# EAGLE board SDR_at86rf215 (EAGLE 7.6.0), part 1 of 2
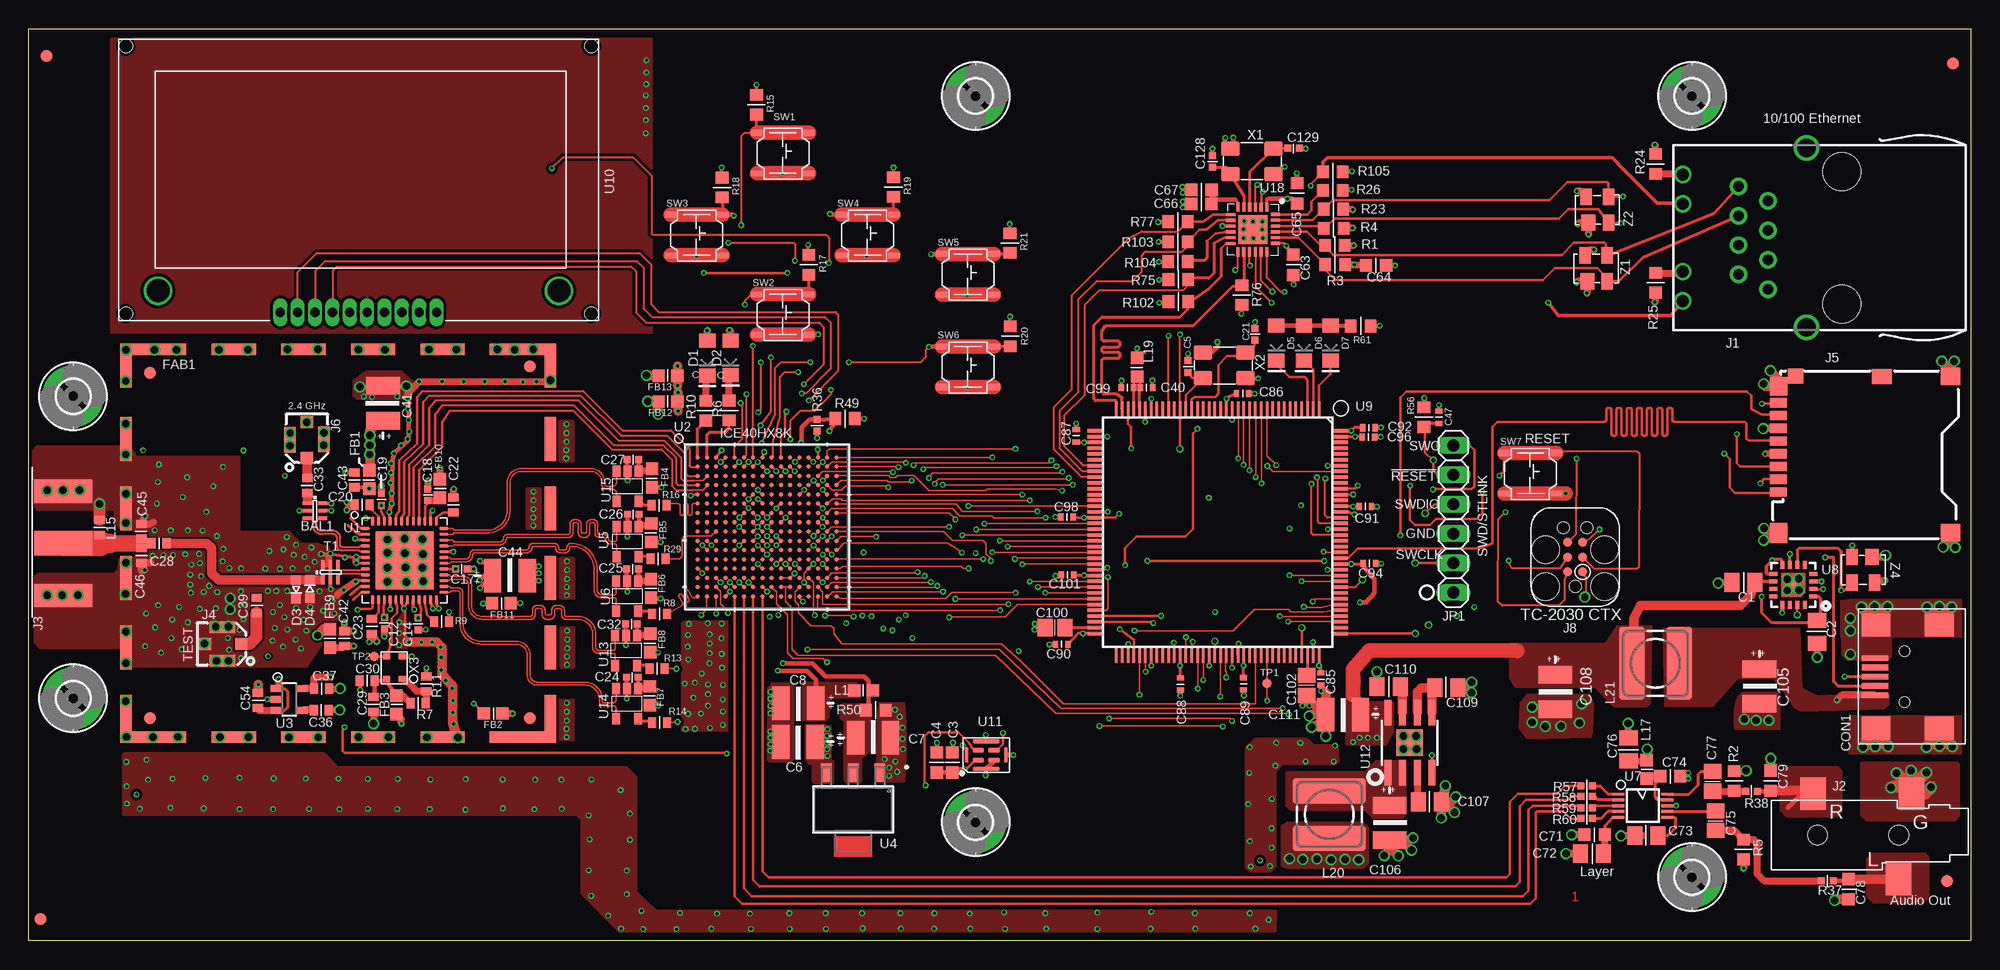
[diagram p10: board, top side]
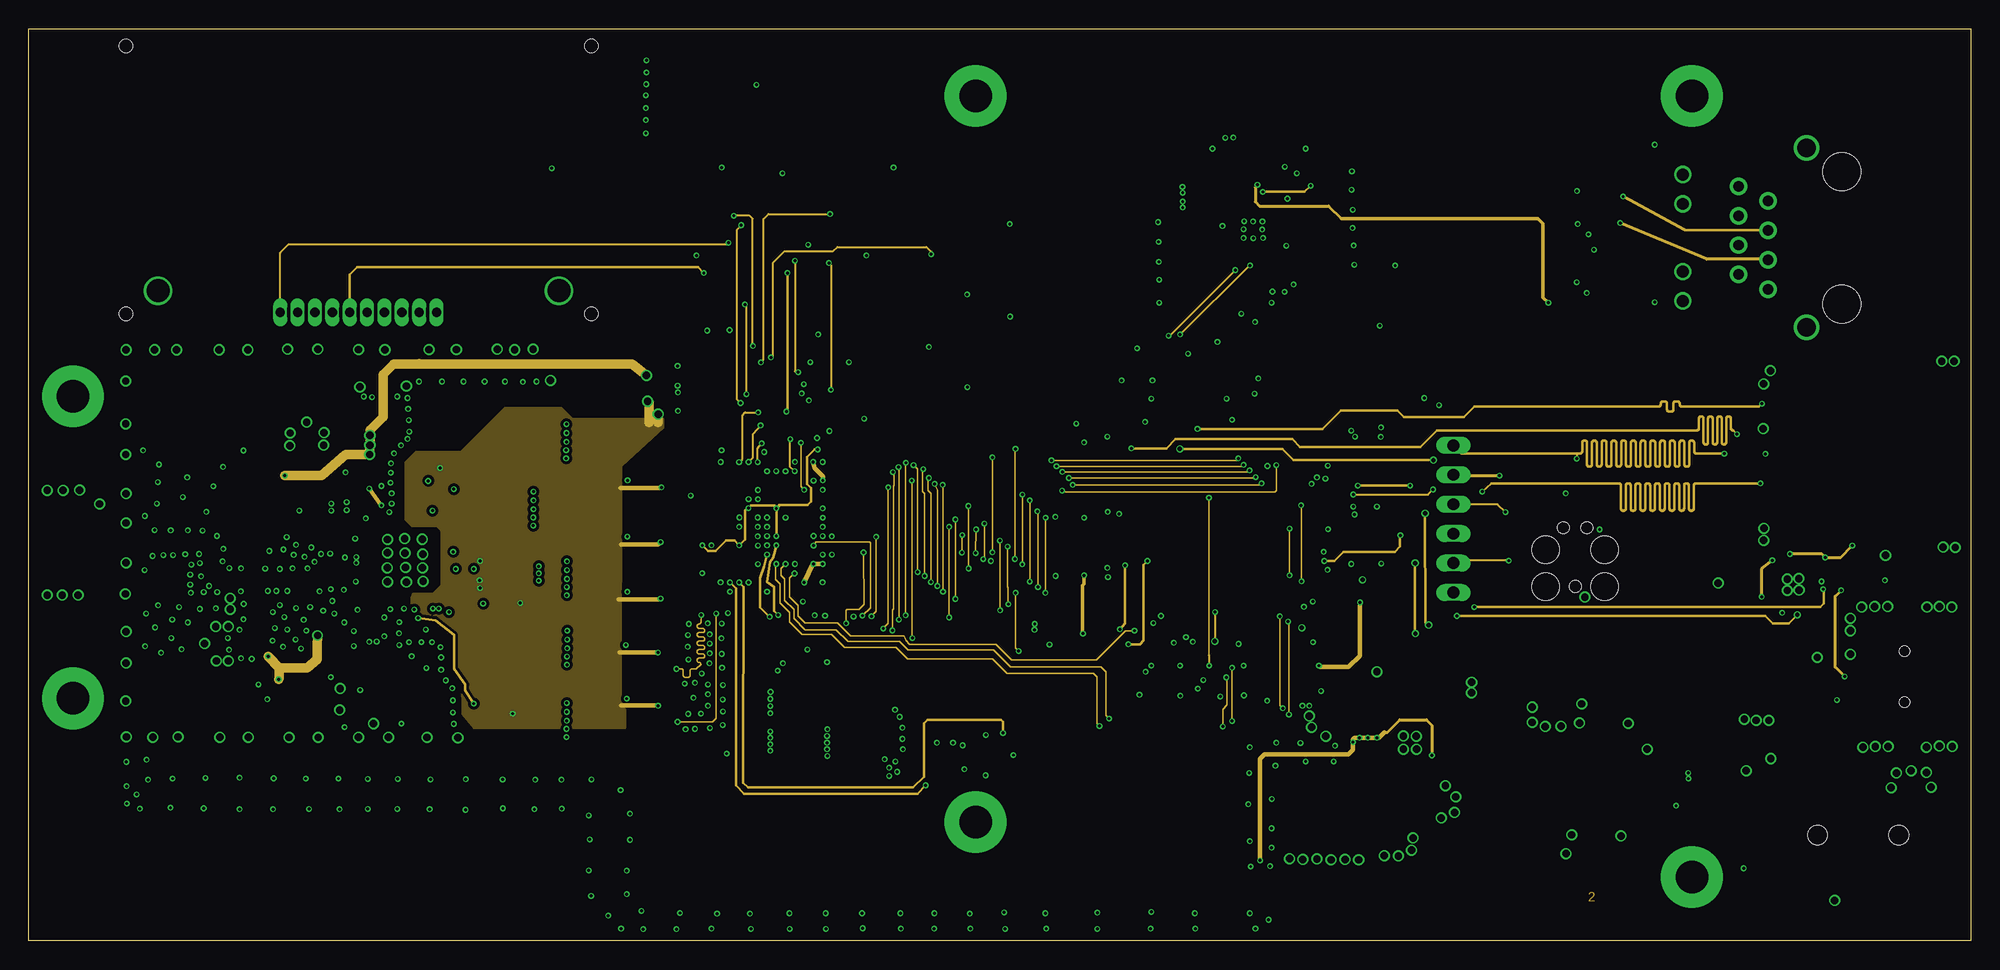
[diagram p11: board, inner layer Route2]
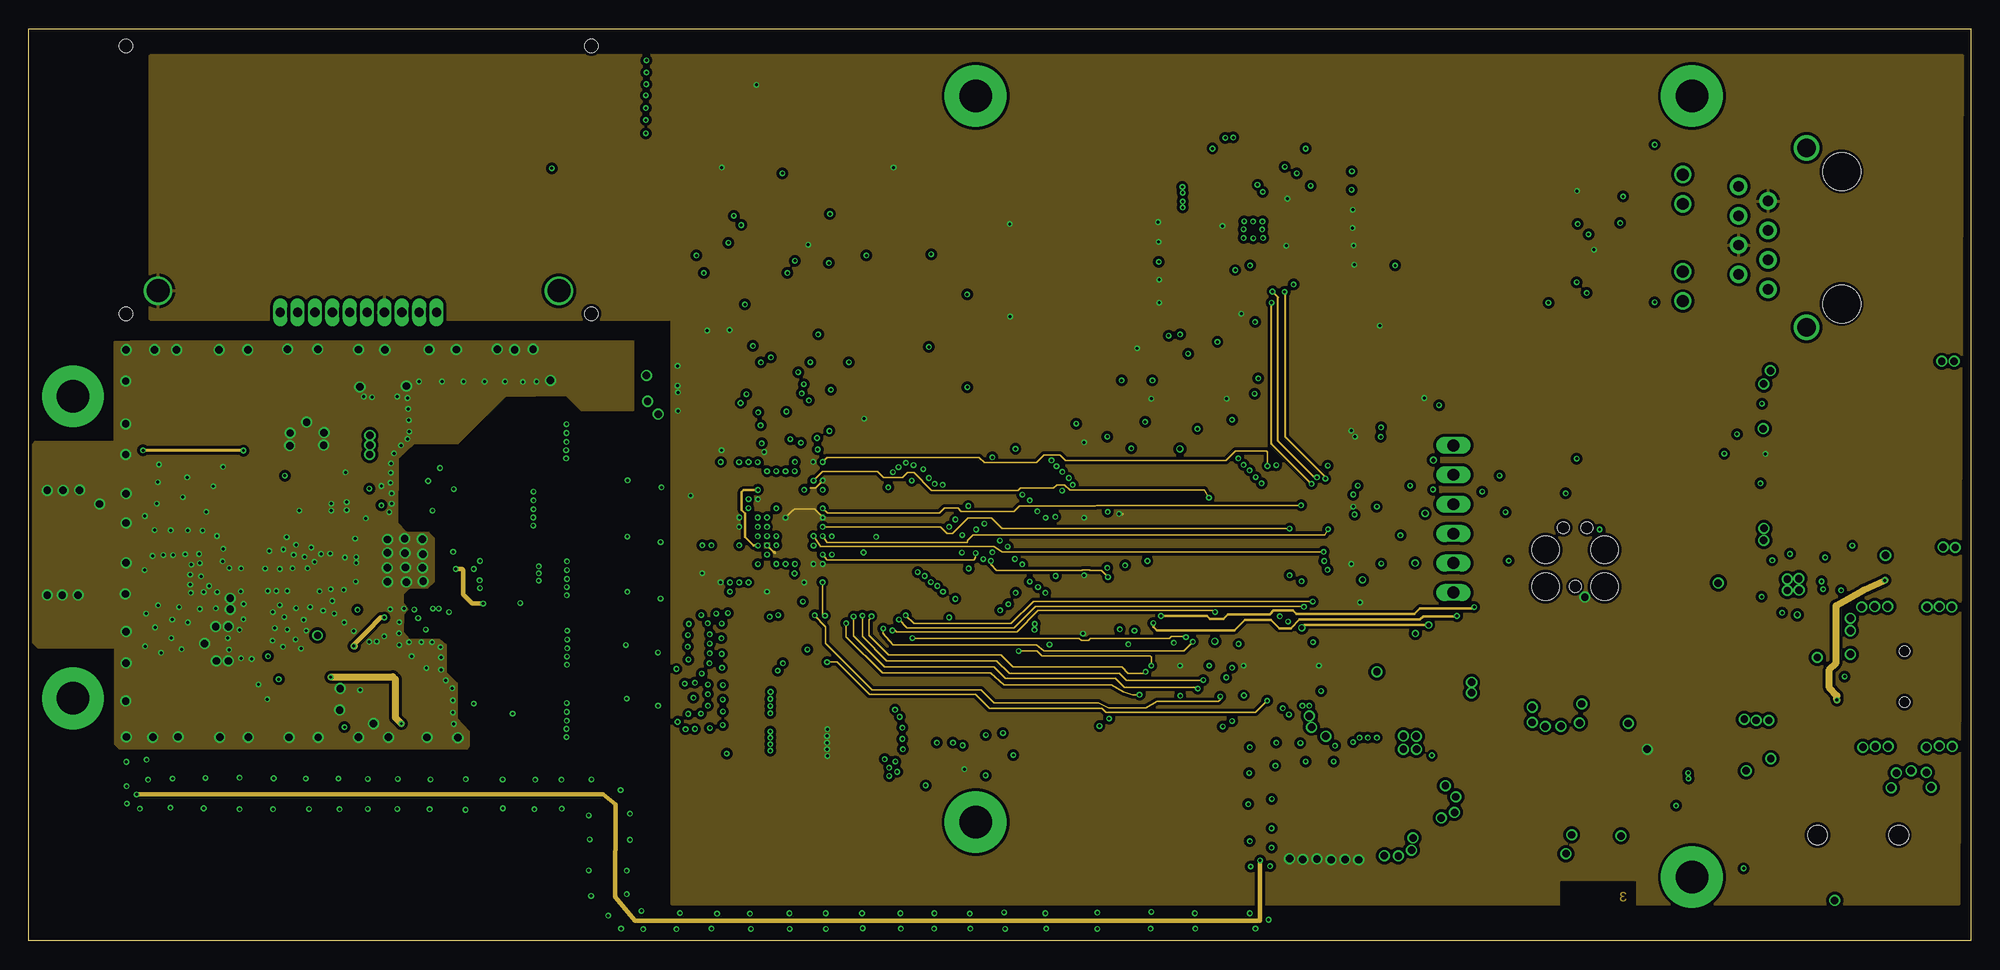
[diagram p12: board, inner layer Route3]
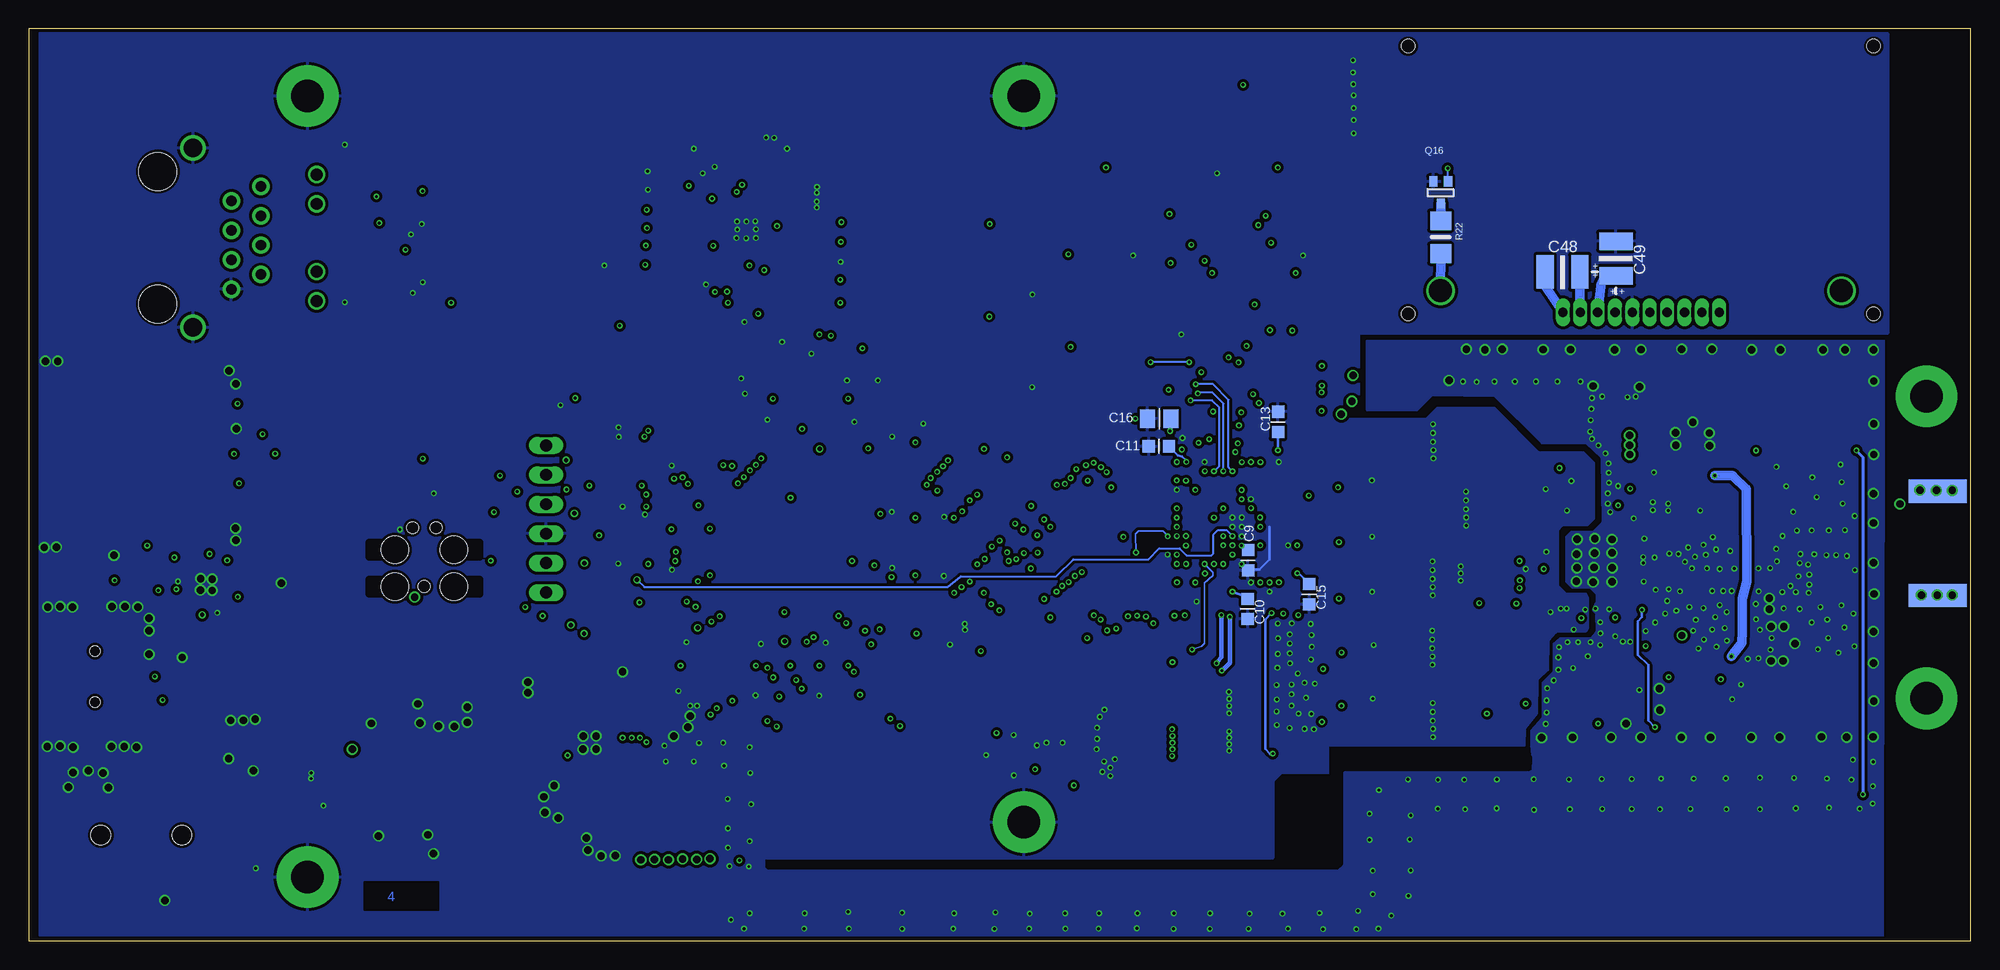
[diagram p13: board, bottom side, seen from below]

Size 167.64 x 78.74 mm. Coordinates in mm from the lower left corner, seen from the top.
Outline: 0,78.74 167.64,78.74 167.64,0 0,0 0,78.74
Copper layers (1+2+3+16): Top 0.035mm / dielectric 0.2mm / Route2 0.035mm / dielectric 0.15mm / Route3 0.035mm / dielectric 0.2mm / Bottom 0.035mm
Design rules "default *": minimum track width 5mil, minimum drill 10mil, track to track 5mil, track to pad 5mil, pad to pad 5mil, via to via 5mil, smd to smd 1mil, copper to edge 10mil, drill to drill 10mil, minimum pad ring 4.5mil, minimum via ring 4.5mil, stop-mask expansion 0mil, vias tented up to drill 25mil, thermal gap 10mil
Net classes: 1 differential: width 0.127 mm, clearance 0.127 mm
tRestrict: area 11,33.9 to 11.4,34.7

## Footprints (pad centres in the part's own frame; a part is rotated, then mirrored left to right if it is on the bottom)
BALUN = smd 0.3 x 0.8: 1 -0.635,-0.66; 2 0.015,-0.66; 3 0.665,-0.66; 4 0.665,0.64; 5 0.015,0.64; 6 -0.635,0.64
C0805 = smd 1.3 x 1.6: 1 -1,0; 2 1,0
C0603 = smd 1.05 x 1.08: 1 -0.875,0; 2 0.875,0
C0402 = smd 0.6 x 0.6: 1 -0.5,0; 2 0.501,0
1210K = smd 1.5 x 2.9: A -1.5,0; C 1.5,0
C0603' = smd 0.699 x 0.899: 1 -0.646,0; 2 0.646,0
0402 = smd 0.457 x 0.61: 1 -0.524,0; 2 0.549,0
C0805' = smd 1.3 x 1.5: 1 -0.85,0; 2 0.85,0
1734035-2 = smd 2.3 x 0.5: 1 2.9,1.45; 2 2.9,0.65; 3 2.9,-0.15; 4 2.9,-0.95; 5 2.9,-1.75 | smd 2.5 x 2: 6 -2.65,-4.6; 7 -2.65,4.3; 8 2.8,-4.6; 9 2.8,4.3 | hole 0.9: 0.35,2.05; 0.35,-2.35
LED-1206 = smd 1.2 x 1.4: A -1.5,0; C 1.5,0
SC-79_PINDIODE = smd 0.813 x 0.813: A -0.813,-0.025; C 0.787,-0.025
RF_SHIELD = smd 5.72 x 1: P$1 -15.56,-16.51; P$6 16.36,-16.51; P$7 -15.56,16.97; P$12 16.36,16.97 | smd 3.8 x 1: P$2 -8.59,-16.51; P$3 -2.59,-16.51; P$4 3.41,-16.51; P$5 9.41,-16.51; P$8 -8.59,16.97; P$9 -2.59,16.97; P$10 3.41,16.97; P$11 9.41,16.97 | smd 1 x 3.14: P$13 -17.92,-14.44; P$19 18.72,-14.44 | smd 1 x 3.8: P$14 -17.92,-8.77; P$15 -17.92,-2.77; P$16 -17.92,3.23; P$17 -17.92,9.23; P$20 18.72,-8.77; P$21 18.72,-2.77; P$22 18.72,3.23; P$23 18.72,9.23 | smd 1 x 2.8: P$18 -17.92,15.07; P$24 18.72,15.07
0603 = smd 1.067 x 1.067: 1 -0.9,0; 2 0.7,0
FIDUCIAL = smd 1.016 x 1.016: 1 0,0
2,8-PAD = drill 2.8 pad 5.334: B2,8 0,0
SI-50170 = drill 0.9 pad 1.5: 1 4.445,5.842; 2 3.175,3.302; 3 1.905,5.842; 4 0.635,3.302; 5 -0.635,5.842; 6 -1.905,3.302; 7 -3.175,5.842; 8 -4.445,3.302 | drill 1.016 pad 1.5: A1 -5.461,10.668; A2 2.921,10.668; C1 -2.921,10.668; C2 5.461,10.668 | drill 1.6 pad 2.2: S1 -7.747,0; S2 7.747,0 | hole 3.251: -5.715,-3.048; 5.715,-3.048
SJ-3523 = smd 2.2 x 2.8: G 8.1,3.6; L 7,-3.8; R -0.4,3.6 | hole 1.7: 0,0; 7,0
SMA_EDGE = smd 2 x 5: GND1 0,0; GND3 9,0 | smd 2 x 5 bottom: GND2 0,0.127; GND4 9,0.127 | smd 2.1 x 5: RF 4.5,0
UFLCONNECTOR = smd 2.2 x 1: 1 0.01,-1.46; 2 -0.01,1.46 | smd 1.05 x 1.05: 3 -1.5,0; RF 1.6,0
SD-502774-001 = smd 0.8 x 1.5: 1 3.26,-7.43; 2 2.16,-7.43; 3 1.06,-7.43; 4 -0.04,-7.43; 5 -1.14,-7.43; 6 -2.24,-7.43; 7 -3.34,-7.43; 8 -4.44,-7.43 | smd 1.29 x 1.7: DET -6.69,1.5 | smd 1.7 x 1.5: GND@1 6.8,-7.4 | smd 1.5 x 1.7: GND@2 6.78,7.44; GND@3 -6.72,7.45 | smd 1.6 x 1.5: GND@4 -5.85,-7.42 | smd 1.29 x 1.3: SW -6.76,-5.94
TC2030-IDC = smd 0.787 x 0.787: 1 -1.27,-0.635; 2 -1.27,0.635; 3 0,-0.635; 4 0,0.635; 5 1.27,-0.635; 6 1.27,0.635 | hole 2.375: -2.54,2.54; 0.635,2.54; 0.635,-2.54; -2.54,-2.54 | hole 1.016: -2.54,0; 2.54,1.016; 2.54,-1.016
1X06 = drill 1.016 long: 1 -6.35,0; 2 -3.81,0; 3 -1.27,0; 4 1.27,0; 5 3.81,0; 6 6.35,0
POWER-CHOKE_WE-TPC = smd 6.3 x 2.2: 1 0,2.05; 2 0,-2.05
SOT23_2N7002_PACKAGE = smd 0.7 x 0.9: 1 -0.642,-0.916; 2 0.641,-0.916; 3 0,0.992
R0603 = smd 1 x 1.1: 1 -0.85,0; 2 0.85,0
R0603_COMPACT = smd 0.7 x 0.9: 1 -0.65,0; 2 0.65,0
R1206 = smd 1.6 x 1.803: 1 -1.422,0; 2 1.422,0
R0402 = smd 0.6 x 0.6: 1 -0.5,0; 2 0.5,0
PBUT_SW_TACTILE_4_5MMX4_5MM = smd 1 x 0.5: 1 -2.2,1.7; 2 2.3,1.7; 3 -2.2,-1.8; 4 2.3,-1.8
TP08R = smd 0.8 x 0.8: TP 0,0
QFN48 = smd 0.8 x 0.3: 1 -3.4,2.75; 2 -3.4,2.25; 3 -3.4,1.75; 4 -3.4,1.25; 5 -3.4,0.75; 6 -3.4,0.25; 7 -3.4,-0.25; 8 -3.4,-0.75; 9 -3.4,-1.25; 10 -3.4,-1.75; 11 -3.4,-2.25; 12 -3.4,-2.75; 25 3.4,-2.75; 26 3.4,-2.25; 27 3.4,-1.75; 28 3.4,-1.25; 29 3.4,-0.75; 30 3.4,-0.25; 31 3.4,0.25; 32 3.4,0.75; 33 3.4,1.25; 34 3.4,1.75; 35 3.4,2.25; 36 3.4,2.75 | smd 0.3 x 0.8: 13 -2.75,-3.4; 14 -2.25,-3.4; 15 -1.75,-3.4; 16 -1.25,-3.4; 17 -0.75,-3.4; 18 -0.25,-3.4; 19 0.25,-3.4; 20 0.75,-3.4; 21 1.25,-3.4; 22 1.75,-3.4; 23 2.25,-3.4; 24 2.75,-3.4; 37 2.75,3.4; 38 2.25,3.4; 39 1.75,3.4; 40 1.25,3.4; 41 0.75,3.4; 42 0.25,3.4; 43 -0.25,3.4; 44 -0.75,3.4; 45 -1.25,3.4; 46 -1.75,3.4; 47 -2.25,3.4; 48 -2.75,3.4 | smd 5 x 5: GPAD 0,0
CABGA256 = smd 0.406 x 0.406: A1 -6,6; A2 -5.2,6; A3 -4.4,6; A4 -3.6,6; A5 -2.8,6; A6 -2,6; A7 -1.2,6; A8 -0.4,6; A9 0.4,6; A10 1.2,6; A11 2,6; A12 2.8,6; A13 3.6,6; A14 4.4,6; A15 5.2,6; A16 6,6; B1 -6,5.2; B2 -5.2,5.2; B3 -4.4,5.2; B4 -3.6,5.2; B5 -2.8,5.2; B6 -2,5.2; B7 -1.2,5.2; B8 -0.4,5.2; B9 0.4,5.2; B10 1.2,5.2; B11 2,5.2; B12 2.8,5.2; B13 3.6,5.2; B14 4.4,5.2; B15 5.2,5.2; B16 6,5.2; C1 -6,4.4; C2 -5.2,4.4; C3 -4.4,4.4; C4 -3.6,4.4; C5 -2.8,4.4; C6 -2,4.4; C7 -1.2,4.4; C8 -0.4,4.4; C9 0.4,4.4; C10 1.2,4.4; C11 2,4.4; C12 2.8,4.4; C13 3.6,4.4; C14 4.4,4.4; C15 5.2,4.4; C16 6,4.4; D1 -6,3.6; D2 -5.2,3.6; D3 -4.4,3.6; D4 -3.6,3.6; D5 -2.8,3.6; D6 -2,3.6; D7 -1.2,3.6; D8 -0.4,3.6; D9 0.4,3.6; D10 1.2,3.6; D11 2,3.6; D12 2.8,3.6; D13 3.6,3.6; D14 4.4,3.6; D15 5.2,3.6; D16 6,3.6; E1 -6,2.8; E2 -5.2,2.8; E3 -4.4,2.8; E4 -3.6,2.8; E5 -2.8,2.8; E6 -2,2.8; E7 -1.2,2.8; E8 -0.4,2.8; E9 0.4,2.8; E10 1.2,2.8; E11 2,2.8; E12 2.8,2.8; E13 3.6,2.8; E14 4.4,2.8; E15 5.2,2.8; E16 6,2.8; F1 -6,2; F2 -5.2,2; F3 -4.4,2; F4 -3.6,2; F5 -2.8,2; F6 -2,2; F7 -1.2,2; F8 -0.4,2; F9 0.4,2; F10 1.2,2; F11 2,2; F12 2.8,2; F13 3.6,2; F14 4.4,2; F15 5.2,2; F16 6,2; G1 -6,1.2; G2 -5.2,1.2; G3 -4.4,1.2; G4 -3.6,1.2; G5 -2.8,1.2; G6 -2,1.2; G7 -1.2,1.2; G8 -0.4,1.2; G9 0.4,1.2; G10 1.2,1.2; G11 2,1.2; G12 2.8,1.2; G13 3.6,1.2; G14 4.4,1.2; G15 5.2,1.2; G16 6,1.2; H1 -6,0.4; H2 -5.2,0.4; H3 -4.4,0.4; H4 -3.6,0.4; H5 -2.8,0.4; H6 -2,0.4; H7 -1.2,0.4; H8 -0.4,0.4; H9 0.4,0.4; H10 1.2,0.4; H11 2,0.4; H12 2.8,0.4; H13 3.6,0.4; H14 4.4,0.4; H15 5.2,0.4; H16 6,0.4; J1 -6,-0.4; J2 -5.2,-0.4; J3 -4.4,-0.4; J4 -3.6,-0.4; J5 -2.8,-0.4; J6 -2,-0.4; J7 -1.2,-0.4; J8 -0.4,-0.4; J9 0.4,-0.4; J10 1.2,-0.4; J11 2,-0.4; J12 2.8,-0.4; J13 3.6,-0.4; J14 4.4,-0.4; J15 5.2,-0.4; J16 6,-0.4; K1 -6,-1.2; K2 -5.2,-1.2; K3 -4.4,-1.2; K4 -3.6,-1.2; K5 -2.8,-1.2; K6 -2,-1.2; K7 -1.2,-1.2; K8 -0.4,-1.2; K9 0.4,-1.2; K10 1.2,-1.2; K11 2,-1.2; K12 2.8,-1.2; K13 3.6,-1.2; K14 4.4,-1.2; K15 5.2,-1.2; K16 6,-1.2; L1 -6,-2; L2 -5.2,-2; L3 -4.4,-2; L4 -3.6,-2; L5 -2.8,-2; L6 -2,-2; L7 -1.2,-2; L8 -0.4,-2; L9 0.4,-2; L10 1.2,-2; L11 2,-2; L12 2.8,-2; L13 3.6,-2; L14 4.4,-2; L15 5.2,-2; L16 6,-2; M1 -6,-2.8; M2 -5.2,-2.8; M3 -4.4,-2.8; M4 -3.6,-2.8; M5 -2.8,-2.8; M6 -2,-2.8; M7 -1.2,-2.8; M8 -0.4,-2.8; M9 0.4,-2.8; M10 1.2,-2.8; M11 2,-2.8; M12 2.8,-2.8; M13 3.6,-2.8; M14 4.4,-2.8; M15 5.2,-2.8; M16 6,-2.8; N1 -6,-3.6; N2 -5.2,-3.6; N3 -4.4,-3.6; N4 -3.6,-3.6; N5 -2.8,-3.6; N6 -2,-3.6; N7 -1.2,-3.6; N8 -0.4,-3.6; N9 0.4,-3.6; N10 1.2,-3.6; N11 2,-3.6; N12 2.8,-3.6; N13 3.6,-3.6; N14 4.4,-3.6; N15 5.2,-3.6; N16 6,-3.6; P1 -6,-4.4; P2 -5.2,-4.4; P3 -4.4,-4.4; P4 -3.6,-4.4; P5 -2.8,-4.4; P6 -2,-4.4; P7 -1.2,-4.4; P8 -0.4,-4.4; P9 0.4,-4.4; P10 1.2,-4.4; P11 2,-4.4; P12 2.8,-4.4; P13 3.6,-4.4; P14 4.4,-4.4; P15 5.2,-4.4; P16 6,-4.4; R1 -6,-5.2; R2 -5.2,-5.2; R3 -4.4,-5.2; R4 -3.6,-5.2; R5 -2.8,-5.2; R6 -2,-5.2; R7 -1.2,-5.2; R8 -0.4,-5.2; R9 0.4,-5.2; R10 1.2,-5.2; R11 2,-5.2; R12 2.8,-5.2; R13 3.6,-5.2; R14 4.4,-5.2; R15 5.2,-5.2; R16 6,-5.2; T1 -6,-6; T2 -5.2,-6; T3 -4.4,-6; T4 -3.6,-6; T5 -2.8,-6; T6 -2,-6; T7 -1.2,-6; T8 -0.4,-6; T9 0.4,-6; T10 1.2,-6; T11 2,-6; T12 2.8,-6; T13 3.6,-6; T14 4.4,-6; T15 5.2,-6; T16 6,-6
SOT23-6 = smd 0.6 x 0.9: 1 -0.72,-1.15; 2 0.23,-1.15; 3 1.18,-1.15; 4 1.18,1.15; 5 -0.71,1.15
SOT-223 = smd 0.914 x 1.6: 1 -2.3,-3.2; 2 0,-3.2; 3 2.3,-3.2
SOT23-5 = smd 0.69 x 0.99: 1 -0.95,-1.29; 2 0,-1.29; 3 0.95,-1.29; 4 0.95,1.3; 5 -0.95,1.3
MSOP10 = smd 0.25 x 1: 1 -1,-2.113; 2 -0.5,-2.113; 3 0,-2.113; 4 0.5,-2.113; 5 1,-2.113; 6 1,2.113; 7 0.5,2.113; 8 0,2.113; 9 -0.5,2.113; 10 -1,2.113
QFN16 = smd 0.7 x 0.35: 1 -1.725,0.975; 2 -1.725,0.325; 3 -1.725,-0.325; 4 -1.725,-0.975; 9 1.725,-0.975; 10 1.725,-0.325; 11 1.725,0.325; 12 1.725,0.975 | smd 0.35 x 0.7: 5 -0.975,-1.725; 6 -0.325,-1.725; 7 0.325,-1.725; 8 0.975,-1.725; 13 0.975,1.725; 14 0.325,1.725; 15 -0.325,1.725; 16 -0.975,1.725 | smd 1 x 1: TAB 0,0
STM32F407_144 = smd 1.35 x 0.32: 1 -10.625,8.75; 2 -10.625,8.25; 3 -10.625,7.75; 4 -10.625,7.25; 5 -10.625,6.75; 6 -10.625,6.25; 7 -10.625,5.75; 8 -10.625,5.25; 9 -10.625,4.75; 10 -10.625,4.25; 11 -10.625,3.75; 12 -10.625,3.25; 13 -10.625,2.75; 14 -10.625,2.25; 15 -10.625,1.75; 16 -10.625,1.25; 17 -10.625,0.75; 18 -10.625,0.25; 19 -10.625,-0.25; 20 -10.625,-0.75; 21 -10.625,-1.25; 22 -10.625,-1.75; 23 -10.625,-2.25; 24 -10.625,-2.75; 25 -10.625,-3.25; 26 -10.625,-3.75; 27 -10.625,-4.25; 28 -10.625,-4.75; 29 -10.625,-5.25; 30 -10.625,-5.75; 31 -10.625,-6.25; 32 -10.625,-6.75; 33 -10.625,-7.25; 34 -10.625,-7.75; 35 -10.625,-8.25; 36 -10.625,-8.75; 73 10.625,-8.75; 74 10.625,-8.25; 75 10.625,-7.75; 76 10.625,-7.25; 77 10.625,-6.75; 78 10.625,-6.25; 79 10.625,-5.75; 80 10.625,-5.25; 81 10.625,-4.75; 82 10.625,-4.25; 83 10.625,-3.75; 84 10.625,-3.25; 85 10.625,-2.75; 86 10.625,-2.25; 87 10.625,-1.75; 88 10.625,-1.25; 89 10.625,-0.75; 90 10.625,-0.25; 91 10.625,0.25; 92 10.625,0.75; 93 10.625,1.25; 94 10.625,1.75; 95 10.625,2.25; 96 10.625,2.75; 97 10.625,3.25; 98 10.625,3.75; 99 10.625,4.25; 100 10.625,4.75; 101 10.625,5.25; 102 10.625,5.75; 103 10.625,6.25; 104 10.625,6.75; 105 10.625,7.25; 106 10.625,7.75; 107 10.625,8.25; 108 10.625,8.75 | smd 0.32 x 1.35: 37 -8.75,-10.625; 38 -8.25,-10.625; 39 -7.75,-10.625; 40 -7.25,-10.625; 41 -6.75,-10.625; 42 -6.25,-10.625; 43 -5.75,-10.625; 44 -5.25,-10.625; 45 -4.75,-10.625; 46 -4.25,-10.625; 47 -3.75,-10.625; 48 -3.25,-10.625; 49 -2.75,-10.625; 50 -2.25,-10.625; 51 -1.75,-10.625; 52 -1.25,-10.625; 53 -0.75,-10.625; 54 -0.25,-10.625; 55 0.25,-10.625; 56 0.75,-10.625; 57 1.25,-10.625; 58 1.75,-10.625; 59 2.25,-10.625; 60 2.75,-10.625; 61 3.25,-10.625; 62 3.75,-10.625; 63 4.25,-10.625; 64 4.75,-10.625; 65 5.25,-10.625; 66 5.75,-10.625; 67 6.25,-10.625; 68 6.75,-10.625; 69 7.25,-10.625; 70 7.75,-10.625; 71 8.25,-10.625; 72 8.75,-10.625; 109 8.75,10.625; 110 8.25,10.625; 111 7.75,10.625; 112 7.25,10.625; 113 6.75,10.625; 114 6.25,10.625; 115 5.75,10.625; 116 5.25,10.625; 117 4.75,10.625; 118 4.25,10.625; 119 3.75,10.625; 120 3.25,10.625; 121 2.75,10.625; 122 2.25,10.625; 123 1.75,10.625; 124 1.25,10.625; 125 0.75,10.625; 126 0.25,10.625; 127 -0.25,10.625; 128 -0.75,10.625; 129 -1.25,10.625; 130 -1.75,10.625; 131 -2.25,10.625; 132 -2.75,10.625; 133 -3.25,10.625; 134 -3.75,10.625; 135 -4.25,10.625; 136 -4.75,10.625; 137 -5.25,10.625; 138 -5.75,10.625; 139 -6.25,10.625; 140 -6.75,10.625; 141 -7.25,10.625; 142 -7.75,10.625; 143 -8.25,10.625; 144 -8.75,10.625
NHD-C0216CZ-NSW-BBW-3V3 = drill 0.8 long: 1 -6.7,-12; 2 -5.2,-12; 3 -3.7,-12; 4 -2.2,-12; 5 -0.7,-12; 6 0.8,-12; 7 2.3,-12; 8 3.8,-12; 9 5.3,-12; 10 6.8,-12 | drill 2: A -17.25,-10.14; K 17.37,-10.14 | hole 1.15: -20.03,10.98; 20.17,10.98; -20.03,-12.12; 20.17,-12.12
HCLGA5P-3X4X1MM = smd 0.95 x 0.4: 1 -0.675,-0.425; 2 0.675,-0.425; 3 0.675,0.425; 4 -0.675,0.425 | smd 2.3 x 0.35: 5 0,-1.2; 7 0,1.2 | smd 0.35 x 1.3: 6 1.7,0; 8 -1.7,0
SO8 = smd 0.6 x 2.2: 1 -1.905,-2.62; 2 -0.635,-2.62; 3 0.635,-2.62; 4 1.905,-2.62; 5 1.905,2.58; 6 0.635,2.58; 7 -0.635,2.58; 8 -1.905,2.58 | smd 2.29 x 2.29: GPAD 0,0
QFN-24 = smd 0.28 x 0.8: 1 -1.205,-1.836; 2 -0.705,-1.836; 3 -0.205,-1.836; 4 0.295,-1.836; 5 0.795,-1.836; 6 1.295,-1.836; 13 1.3,2.03; 14 0.8,2.03; 15 0.3,2.03; 16 -0.2,2.03; 17 -0.7,2.03; 18 -1.2,2.03 | smd 0.8 x 0.28: 7 1.94,-1.191; 8 1.94,-0.691; 9 1.94,-0.191; 10 1.94,0.309; 11 1.94,0.809; 12 1.94,1.309; 19 -1.929,1.3; 20 -1.929,0.8; 21 -1.929,0.3; 22 -1.929,-0.2; 23 -1.929,-0.7; 24 -1.929,-1.2 | smd 2.5 x 2.5: GP 0,0.1
ECS-250-20-30B-DU_CRYSTAL = smd 1.6 x 1.25: 1 -1.9,-1.1; 3 1.8,1.1; GND@1 -1.9,1.1; GND@2 1.8,-1.1
CRYSTAL_2.5_2MM = smd 0.5 x 0.6: GND 1,-0.6; OUTPUT 1,0.75; VCC -0.95,-0.6; VDD -0.95,0.75
SR2.8.TCT_1PRIMARY = smd 1.397 x 1.194: 1 -1.168,0.813 | smd 1.397 x 0.991: 2 -1.168,-0.914; 3 1.067,-0.914; 4 1.067,1.016

## Placement (x,y rotation side)
BAL1  2450FB15A0100  [BALUN]  24.71,37.13 270 top
C1  10uF  [C0805]  148.03,30.94 180 top
C2  10uF  [C0805]  154.38,26.67 270 top
C3  0.1uF  [C0603]  79.73,15.39 90 top
C4  1uF  [C0603]  78.38,15.39 90 top
C5  10pF  [C0402]  100.08,49.58 270 top
C6  22uF  [1210K]  66.41,17.17 180 top
C7  22uF  [1210K]  72.89,17.53 0 top
C8  22uF  [1210K]  66.42,20.5 180 top
C9  0.1uF  [C0603]  62.38,32.85 270 bottom
C10  1uF  [C0603]  62.41,28.65 270 bottom
C11  1uF  [C0603]  70.08,42.7 180 bottom
C12  .1uF  [C0402]  30.71,27.43 90 top
C13  1uF  [C0603]  59.79,44.81 90 bottom
C14  .1uF  [C0402]  33.6,27.36 90 top
C15  1uF  [C0603]  57.1,29.92 270 bottom
C16  2.2uF  [C0805]  70.05,45.08 180 bottom
C17  .1uF  [C0402]  37.34,32.11 180 top
C18  .1uF  [C0402]  34.44,38.51 270 top
C19  .1uF  [C0402]  30.43,38.1 270 top
C20  0.47uF  [C0603']  28.78,37.64 180 top
C21  10pF  [C0402]  105.87,52.37 270 top
C22  0.47uF  [C0603']  36.65,37.62 90 top
C23  0.47uF  [C0603']  29.62,27.15 270 top
C24  .1uF  [C0402]  52.1,22.76 180 top
C25  .1uF  [C0402]  52.12,32.11 180 top
C26  .1uF  [C0402]  52.17,36.83 180 top
C27  .1uF  [C0402]  52.15,41.55 180 top
C28  100pF  [C0603']  11.23,34.32 0 top
C29  2.2uF  [C0603']  29.74,20.4 270 top
C30  100pF  [C0603']  29.21,22.45 0 top
C32  .1uF  [C0402]  52.02,27.36 180 top
C33  100pF  [C0603']  24.03,39.32 270 top
C36  .01uF  [C0603']  25.25,19.91 0 top
C37  2.2uF  [C0603']  25.27,21.77 0 top
C39  100pF  [C0603']  19.66,28.96 90 top
C40  0.1uF  [0402]  96.47,47.78 0 top
C41  470uF_tant  [1210K]  30.58,46.41 90 top
C42  2.2uF  [C0603']  27.23,26.09 90 top
C43  2.2uF  [C0603']  28.09,39.8 90 top
C44  470uF_tant  [1210K]  41.53,31.52 0 top
C45  DNP  [C0603']  9.7,35.36 270 top
C46  DNP  [C0603']  9.7,33.27 90 top
C47  0.1uF  [0402]  121.74,45.19 90 top
C48  22uF  [1210K]  35.23,57.76 180 bottom
C49  22uF  [1210K]  30.61,58.9 90 bottom
C54  2.2uF  [C0603']  19.79,20.75 90 top
C63  0.1uF  [C0603]  109.17,58.37 270 top
C64  0.1uF  [C0603]  116.31,58.32 0 top
C65  0.1uF  [C0603]  109.5,64.54 90 top
C66  1uF  [C0603]  101.22,63.63 180 top
C67  0.1uF  [C0603]  101.24,64.82 180 top
C71  0.1uF  [C0603]  135.18,9.14 180 top
C72  10uF  [C0805]  134.95,7.52 180 top
C73  10uF  [C0805]  139.65,9.09 0 top
C74  0.1uF  [C0603]  141.71,14.2 0 top
C75  2.2uF  [C0805']  145.62,10.36 90 top
C76  2.2uF  [C0805]  138.1,16.51 90 top
C77  2.2uF  [C0805']  145.36,13.77 90 top
C78  8200pF  [C0603]  157.12,4.45 270 top
C79  8200pF  [C0603]  150.39,13.82 90 top
C85  0.1uF  [0402]  111.56,22.61 270 top
C86  0.1uF  [0402]  104.77,47.24 0 top
C87  0.1uF  [0402]  90.42,43.59 90 top
C88  0.1uF  [0402]  99.42,22.17 270 top
C89  0.1uF  [0402]  104.88,22.2 270 top
C90  0.1uF  [0402]  89.18,25.6 180 top
C91  0.1uF  [0402]  115.37,37.49 0 top
C92  0.1uF  [0402]  115.67,44.3 0 top
C94  0.1uF  [0402]  115.72,32.56 0 top
C96  0.1uF  [0402]  115.65,43.48 0 top
C98  0.1uF  [0402]  89.64,36.6 180 top
C99  0.1uF  [0402]  94.87,47.78 180 top
C100  2.2uF  [C0805']  88.6,27.03 180 top
C101  0.1uF  [0402]  89.69,31.6 180 top
C102  2.2uF  [C0805']  110.31,22.05 270 top
C105  470uF_tant  [1210K]  149.4,21.97 270 top
C106  470uF_tant  [1210K]  117.47,10.19 270 top
C107  2.2uF  [C0805]  120.95,11.99 0 top
C108  470uF_tant  [1210K]  131.78,21.49 270 top
C109  2.2uF  [C0805]  122.38,21.87 0 top
C110  2.2uF  [C0805]  117.4,21.95 180 top
C111  22uF  [1210K]  113.46,19.53 180 top
C128  10pF  [C0402]  102.18,67.28 270 top
C129  10pF  [C0402]  109.19,68.43 180 top
CON1  1734035-2  [1734035-2]  162.28,22.66 180 top
D1  [LED-1206]  58.57,50.32 270 top
D2  [LED-1206]  60.58,50.34 270 top
D3  SMP1321-079LFSMD  [SC-79_PINDIODE]  23.09,30.33 270 top
D4  SMP1321-079LFSMD  [SC-79_PINDIODE]  24.23,30.38 90 top
D5  [LED-1206]  107.7,51.61 270 top
D6  [LED-1206]  110.08,51.61 270 top
D7  [LED-1206]  112.39,51.61 270 top
FAB1  2118724  [RF_SHIELD]  26.29,34.09 0 top
FB1  [0603]  29.39,39.73 270 top
FB2  [0603]  40.18,19.63 0 top
FB3  [0603]  31.72,20.47 90 top
FB4  [0603]  53.8,39.85 270 top
FB5  [0603]  53.75,35.13 270 top
FB6  [0603]  53.72,30.33 270 top
FB7  [0603]  53.59,21.06 270 top
FB8  [0603]  53.64,25.6 270 top
FB9  [0603]  26.01,26.01 270 top
FB10  [0603]  35.48,39.14 90 top
FB11  [0603]  40.89,29.16 0 top
FB12  [0603]  55.07,46.56 180 top
FB13  [0603]  55.07,48.79 180 top
FID1  FIDUCIALSMD  [FIDUCIAL]  165.61,5.16 0 top
FID2  FIDUCIALSMD  [FIDUCIAL]  1.5,76.4 0 top
FID3  FIDUCIALSMD  [FIDUCIAL]  166.14,75.77 0 top
FID4  FIDUCIALSMD  [FIDUCIAL]  1.02,1.85 0 top
FID5  FIDUCIALSMD  [FIDUCIAL]  10.46,19.2 0 top
FID6  FIDUCIALSMD  [FIDUCIAL]  10.46,49.02 0 top
FID7  FIDUCIALSMD  [FIDUCIAL]  43.26,19.2 0 top
FID8  FIDUCIALSMD  [FIDUCIAL]  43.26,49.61 0 top
H1  MOUNT-PAD-ROUND2.8  [2,8-PAD]  81.74,72.95 0 top
H2  MOUNT-PAD-ROUND2.8  [2,8-PAD]  81.74,10.24 0 top
H3  MOUNT-PAD-ROUND2.8  [2,8-PAD]  143.59,72.95 0 top
H4  MOUNT-PAD-ROUND2.8  [2,8-PAD]  143.59,5.49 0 top
H5  2.8mm  [2,8-PAD]  3.81,20.93 0 top
H6  2.8mm  [2,8-PAD]  3.81,47.02 0 top
J1  SI-50170  [SI-50170]  153.47,60.71 90 top
J2  SJ-3523  [SJ-3523]  154.43,9.12 0 top
J3  SMA0.062  [SMA_EDGE]  2.97,29.82 90 top
J4  AMPHENOL_A-1JB  [UFLCONNECTOR]  16.71,25.63 0 top
J5  5027740891  [SD-502774-001]  158.47,42.01 270 top
J6  AMPHENOL_A-1JB  [UFLCONNECTOR]  24,43.28 270 top
J8  TC2030-CTX  [TC2030-IDC]  133.5,33.12 90 top
JP1  [1X06]  122.99,36.42 90 top
L1  [0603]  71.96,21.62 180 top
L15  12nH  [C0603']  6.1,35.69 90 top
L17  [0603]  139.67,14.88 90 top
L19  [0603]  95.69,49.42 270 top
L20  22uH_744053220  [POWER-CHOKE_WE-TPC]  112.27,10.9 0 top
L21  22uH_744053220  [POWER-CHOKE_WE-TPC]  140.44,23.95 90 top
Q16  2N7002  [SOT23_2N7002_PACKAGE]  45.75,64.64 180 bottom
R1  49.9  [R0603]  112.75,60.05 180 top
R2  12.1k  [R0603]  147.22,13.79 90 top
R3  49.9  [R0603]  112.78,58.39 180 top
R4  49.9  [R0603]  112.65,61.52 180 top
R5  12.1k  [R0603]  148.03,7.87 270 top
R6  270  [R0603]  60.45,45.8 270 top
R7  470  [R0603_COMPACT]  33.6,20.5 0 top
R8  22  [R0603_COMPACT]  54.46,28.22 180 top
R9  DNP  [R0603_COMPACT]  35.64,27.56 0 top
R10  270  [R0603]  58.45,45.77 270 top
R11  470  [R0603_COMPACT]  34.32,22.17 90 top
R13  22  [R0603_COMPACT]  54.23,23.5 180 top
R14  22  [R0603_COMPACT]  54.46,18.85 180 top
R15  12.1k  [R0603]  62.81,72.19 270 top
R16  22  [R0603_COMPACT]  54.41,37.59 0 top
R17  12.1k  [R0603]  67.34,58.37 270 top
R18  12.1k  [R0603]  59.84,65.05 270 top
R19  12.1k  [R0603]  74.65,65.07 270 top
R20  12.1k  [R0603]  84.73,52.2 270 top
R21  12.1k  [R0603]  84.71,60.25 270 top
R22  82  [R1206]  45.75,60.76 270 bottom
R23  49.9  [R0603]  112.62,63.17 180 top
R24  270  [R0603]  140.44,67.08 90 top
R25  270  [R0603]  140.44,56.82 270 top
R26  12.1k  [R0603]  112.57,64.8 0 top
R29  22  [R0603_COMPACT]  54.33,32.97 0 top
R36  470  [R0402]  68.05,44.5 270 top
R37  470  [R0402]  155.27,5.16 180 top
R38  470  [R0402]  148.72,12.9 180 top
R49  49.9  [R0603]  70.46,45.08 0 top
R50  120  [R0603]  73.11,19.91 180 top
R56  12.1k  [R0603]  120.45,45.21 270 top
R57  470  [R0402]  134.49,13.36 180 top
R58  470  [R0402]  134.49,12.45 180 top
R59  470  [R0402]  134.49,11.48 180 top
R60  470  [R0402]  134.49,10.57 180 top
R61  270  [R0603]  114.99,53.09 180 top
R75  12.1k  [R0603]  99.24,57.1 0 top
R76  12.1k  [R0603]  104.72,55.75 90 top
R77  12.1k  [R0603]  99.21,62.1 0 top
R102  12.1k  [R0603]  99.24,55.19 0 top
R103  12.1k  [R0603]  99.21,60.35 0 top
R104  12.1k  [R0603]  99.21,58.65 180 top
R105  12.1k  [R0603]  112.57,66.4 0 top
SW1  45X45MM_TL3315  [PBUT_SW_TACTILE_4_5MMX4_5MM]  65.05,68.07 0 top
SW2  45X45MM_TL3315  [PBUT_SW_TACTILE_4_5MMX4_5MM]  65.05,54.13 0 top
SW3  45X45MM_TL3315  [PBUT_SW_TACTILE_4_5MMX4_5MM]  57.61,60.99 0 top
SW4  45X45MM_TL3315  [PBUT_SW_TACTILE_4_5MMX4_5MM]  72.36,60.99 0 top
SW5  45X45MM_TL3315  [PBUT_SW_TACTILE_4_5MMX4_5MM]  81.03,57.61 0 top
SW6  45X45MM_TL3315  [PBUT_SW_TACTILE_4_5MMX4_5MM]  81.03,49.61 0 top
SW7  45X45MM_TL3315  [PBUT_SW_TACTILE_4_5MMX4_5MM]  129.59,40.41 0 top
T1  0896FB15A0100  [BALUN]  26.01,31.83 0 top
TP1  PTR1TP08R  [TP08R]  106.91,22.23 0 top
TP2  PTR1TP08R  [TP08R]  29.82,24.56 0 top
U1  AT86RF215  [QFN48]  32.44,32.84 0 top
U2  ICE40HX8K-CT256  [CABGA256]  63.73,35.74 0 top
U3  TPS799X  [SOT23-6]  22.48,21.06 270 top
U4  LD1117S12TR  [SOT-223]  71.16,11.33 180 top
U5  SN65LVDT2  [SOT23-5]  51.69,34.47 180 top
U6  SN65LVDT2  [SOT23-5]  51.66,29.74 180 top
U7  CS4344  [MSOP10]  139.34,11.66 270 top
U8  FT230XQ  [QFN16]  152.35,30.71 180 top
U9  STM32H743ZIT6  [STM32F407_144]  102.64,35.28 270 top
U10  NHD-C0216CZ-NSW-BBW-3V3  [NHD-C0216CZ-NSW-BBW-3V3]  28.4,66.27 0 top
U11  MP34DT05TR-A  [HCLGA5P-3X4X1MM]  82.65,16.03 0 top
U12  ADP7156ARDZ-3.3-R7  [SO8]  119.23,17.12 0 top
U13  SN65LVDS1  [SOT23-5]  51.56,25.07 180 top
U14  SN65LVDS1  [SOT23-5]  51.64,20.47 180 top
U15  SN65LVDT2  [SOT23-5]  51.69,39.24 180 top
U18  LAN8742  [QFN-24]  105.69,61.52 180 top
X1  25MHz  [ECS-250-20-30B-DU_CRYSTAL]  105.64,67.31 0 top
X2  8MHZ  [ECS-250-20-30B-DU_CRYSTAL]  103.15,49.68 180 top
X3  ASVTX-12-A-40.000MHZ-H10-T  [CRYSTAL_2.5_2MM]  31.62,23.55 90 top
Z1  CD143A-SR05  [SR2.8.TCT_1PRIMARY]  135.36,58.12 90 top
Z2  CD143A-SR05  [SR2.8.TCT_1PRIMARY]  135.46,63.17 90 top
Z4  CD143A-SR05  [SR2.8.TCT_1PRIMARY]  158.32,31.98 270 top

## Tracks (layer width: path | path; a pad name or v marks a point on that pad's centre or on a via)
3V
  Top 0.254: 30.79,22.52 X3.VDD
  Top 0.406: 30.79,22.52 30.82,22.49 | 30.82,22.49 C30.2 29.84,21.51 C29.1 | 30.82,22.49 FB3.2
  Top 0.61: FB3.2 32.28,21.17 R7.1
3V3  (via drill 0.25, 0.25 pad 0.25, 0.25 pad 0.41, 0.64)
  Top 0.127: U2.N13 66.93,31.72 v66.93,30.94
  Top 0.152: J8.1 134.21,31.7 134.42,31.37 134.42,29.87 v134.34,29.67
  Top 0.203: v61.34,36.55 U2.G6 | v62.94,38.13 U2.F8 | U2.H10 | U2.H10 v65.33,36.54 | U2.J6 | U2.J6 v61.33,35.74 | v57.14,38.44 57.49,38.55 U2.E1 | U2.A3 v59.8,42.35 | U2.A8 v63.47,42.2 | U2.A13 v67.72,41.35 | U2.C15 | U2.C15 v68.54,39.75 | v68.54,36.53 68.53,36.54 U2.H15 | U2.N15 68.57,32.55 v68.53,32.54 68.49,32.5 | v67.73,32.54 | v67.73,32.54 U2.N13 | v66.93,30.94 U2.R13 | U2.R8 | U2.R8 v63.73,30.14 | U2.P3 v59.72,30.95 | U2.N1 v58.13,31.74 | 91.87,36.53 93.81,36.53 v94.13,36.86 | v91.11,43.03 90.95,43.03 90.8,43 90.4,43.03 C87.1 | U2.K8 | U2.K8 v63.73,34.14 | U18.19 108.36,60.22 v108.56,60.02 109.17,59.41 | U18.9 103.11,61.71 v103.05,61.72
  Top 0.254: U9.143 114.17,43.53 v114.5,43.54 115.02,43.59 C96.1 | U9.144 114.17,44.03 v114.17,44.04 114.43,44.3 C92.1 | U9.121 v114.17,32.53 v114.17,32.54 115.17,32.54 C94.1 | U9.131 114.17,37.53 v114.35,37.49 | U9.108 v111.38,23.75 111.53,23.6 C85.1 | U9.95 104.88,24.66 v104.88,23.75 C89.1 | U9.84 v99.39,23.75 99.42,23.72 C88.1 | U9.72 v91.01,26.53 | v91.01,26.53 91.01,26.52 | U9.62 91.11,31.53 | 91.11,31.53 v91.11,31.55 | U9.52 91.87,36.53 91.24,36.53 91.24,36.47 91.11,36.47 v91.11,36.53 91.11,36.5 C98.1 | U9.39 v91.11,43.03 | U9.30 96.9,45.91 v96.9,46.81 | U9.17 103.4,45.91 v103.4,46.81 103.45,46.86 C86.1 | 91.11,31.53 90.59,31.53 C101.1 | v91.01,26.53 90.57,26.53 C90.1 | C91.1 v114.35,37.49 | 114.2,37.49 v114.35,37.49 | L19.1 95.69,50.68 v95.68,51.16 | R76.1 104.67,54.85 | R77.1 98.31,62.05 | R75.1 98.36,57.07 | R102.1 98.29,55.09 | U18.1 106.88,63.5 106.88,64.06 107.01,64.08 | 109.46,63.67 C65.1 | U18.19 | 109.17,59.41 C63.1 | R3.1 113.61,58.41 | 113.61,60.17 113.6,60.16 R1.1 113.5,60.15 | 113.84,61.6 R4.1 | R23.1 113.5,63.14 | U11.1 81.72,15.6 80.95,14.83 80.05,14.83 79.88,14.66 C3.1 | R15.1 v62.81,73.91 | R18.1 59.82,65.92 v59.82,66.78 | R19.1 v74.65,66.78 | R17.1 67.28,59.27 v67.28,60.1 | R21.1 84.68,61.12 v84.68,61.9 | R20.1 84.71,53.07 v84.71,53.9
  Top 0.406: R56.1 v120.47,46.86 | R61.1 v116.64,53.11 | v114.93,29.21 115.42,29.21 116.18,30.02 116.18,31.24 115.24,32.33 115.21,32.54 C94.1 | 104.67,54.85 v104.67,54.15 | 98.31,62.05 v97.49,62.05 | R103.1 v97.54,60.35 | 98.36,57.07 v97.59,57.07 | 98.29,55.09 v97.59,55.09 | 107.01,64.08 v108.66,64.08 109.09,64.08 109.46,63.67 | C64.1 115.48,58.32 | R49.2 v72.11,45.09 | 78.18,14.38 C4.1 C3.1 | v80.77,14.81 80.02,14.81 79.88,14.66
  Top 0.61: C76.1 138.15,15.46 L17.2 139.73,15.51 v139.73,16.54 | D2.A 60.58,52.64 v60.49,52.73 | D1.A 58.57,52.68 v58.56,52.69 | v114.43,58.37 R3.1 C64.1 | 113.61,60.17 v114.38,60.05 | v114.27,61.54 R4.1 | v114.3,63.12 R23.1 | Z2.4 133.93,64.74 v133.65,64.74 | Z1.4 134.82,59.66 v135.13,59.66 | J5.4 v149.94,42.04
  Top 0.813: v56.03,47.35 56.03,46.62 FB12.1 | v56.03,45.75 56.03,46.53 | v56.01,47.93 56.01,48.75 FB13.1 | v56.01,49.63 56.01,48.82 55.98,48.79
  Route2 0.152: 67.69,41.35 v67.72,41.35
  Route2 0.305: v91.11,31.55 91.11,30.81 90.98,30.68 90.98,26.56 v91.01,26.53
  Route2 0.406: v68.54,39.75 68.54,40.09 67.82,40.82 67.69,41.35 | v66.93,30.94 67.72,32.59 | v67.73,32.54 v68.53,32.54 | 111.48,23.65 113.94,23.65 114.91,24.61 114.91,29.18 v114.93,29.21
  Route3 0.127: v68.54,36.53 68.54,36.56 67.84,37.26 66.09,37.26 65.99,37.16 65.95,37.16 v65.33,36.54 | v68.54,39.75 68.54,39.74 68.33,39.52 | 67.44,39.09 67.89,39.09 68.33,39.52 | 68.35,39.52 68.33,39.52
  Route3 0.203: v94.13,36.86 94.41,36.86 | v63.73,34.14 63.73,34.11 64.29,33.55 64.36,33.55 64.41,33.5
  Bottom 0.203: v58.13,31.74 58.04,31.74 C15.1 | v67.72,41.35 67.72,41.45 68.1,41.83 68.43,41.91 C11.1 | v59.8,42.35 59.8,43.92 C13.1 | v63.73,30.14 63.09,29.88 C10.1
  other vias: 114.81,6.98 113.64,7.01 112.42,6.98 111.2,7.06 109.98,7.01 108.84,7.09 68.94,18.26 68.91,17.68 68.91,17.09 68.91,16.54 68.94,15.95
  pour Top (no thermals): 115.54,9.78 115.54,6.65 115.16,6.27 108.64,6.27 108.23,6.48 108.23,9.93 108.69,10.19 115.14,10.19
  pour Route3 (isolate 0.254): 10.49,76.45 166.93,76.45 166.62,3.15 55.52,3.15 55.52,53.64 10.49,53.64
  pour Top (no thermals): 67.72,13.74 67.72,15.29 67.87,15.44 69.44,15.49 69.44,13.64 67.82,13.64
  pour Top (no thermals): 67.69,15.29 67.41,15.29 67.11,15.72 67.11,18.59 68.58,18.64 69.19,18.49 69.19,15.6 68.4,15.27
3V_ANALOG
  Top 0.254: U9.32 95.89,47.22 C40.1 95.94,48.23 L19.2 95.39,48.48 C99.1 95.39,47.17 U9.33
20MHZ_REF
  Top 0.203: U9.23 100.39,46.75 100.61,46.96 102.44,46.96 102.72,47.24 102.72,49.73 103.45,50.47 104.74,50.47 X2.1 105.19,50.78 105.79,51.38 105.87,51.82 C21.2
!RESET  (via drill 0.25, 0.38)
  Top 0.152: U9.25 v99.39,52.35 | v105.44,58.32 105.39,58.39 U18.15 | SW7.2 132.02,42.24 138.84,42.24 139.06,42.01 139.04,32.33 138.84,32.13 135.13,32.13 J8.3
  Top 0.203: v99.36,42.47 99.36,45.88 U9.25 | R56.2 120.55,44.26 120.55,42.16 121.21,41.5 v121.26,41.5 121.26,40.59 121.74,40.11 122.86,40.11 JP1.5
  Top 0.254: C47.1 120.75,44.66 R56.2 | v126.97,40.16 127.39,40.57 SW7.1
  Top 1.27: SW7.1 SW7.2
  Route2 0.152: v99.39,52.35 105.36,58.32 v105.44,58.32
  Route2 0.203: v121.26,41.5 109.19,41.5 108.23,42.47 v99.36,42.47
  Route2 0.254: JP1.5 123.06,40.16 v126.97,40.16
+5V  (via drill 0.25)
  Top 0.254: v121.13,16 U12.4 | 138.48,24.92 138.33,24.77 138.33,24.01 L21.1
  Top 0.305: U8.10 149.13,31.03 C1.1
  Top 0.61: 149.07,31.14 149.02,31.09 149.02,30.95 C1.1
  Top 0.813: 138.51,24.08 138.53,24.05 138.53,23.9 138.56,23.93 138.56,27.81 139.14,28.93 147.75,28.93 148.67,29.85 148.89,30.65 149.13,31.03 | C111.A 114.96,20.57 114.3,21.23
  Top 1.27: 114.3,21.23 114.33,23.44 115.72,25.07 128.35,25.07 128.5,25.04
  Route2 0.254: v121.13,16 121.13,18.59 120.68,19.08 118.36,19.08 117.3,18.01 117.02,18.01 116.99,17.98
  Route2 0.381: v106.3,6.93 106.3,15.7 106.68,16.08 113.94,16.08 114.33,16.46 114.33,17.4 114.45,17.53 v116.38,17.53 116.56,17.53 117.02,18.01
  Route3 0.254: v18.52,42.33 9.87,42.33 v9.86,42.34
  Route3 0.381: v9.3,12.62 49.58,12.62 50.65,11.79 50.62,3.78 52.32,1.73 106.3,1.73 v106.3,6.93
  Bottom 0.254: v9.86,42.34 9.86,42.32 9.3,41.76 v9.3,12.62
  other vias: 114.88,17.53 115.6,17.53 114.33,17.14
  pour Top (no thermals): 136.14,25.63 137.19,27.2 140.06,27.13 139.9,20.5 139.65,20.24 136.91,20.24 135.23,21.92 128.42,21.92 127.94,22.68 127.94,25.63
  pour Top (no thermals): 117.73,20.47 117.73,18.08 117.12,16.97 113.77,16.94 113.82,17.83 113.82,22.89 114.86,22.89 114.83,21.21 114.91,20.62 117.6,20.6
ADDR0  (via drill 0.25)
  Top 0.127: U2.C16 69.75,40.16 74.24,40.16 74.4,40.01 74.83,40.01 74.98,40.16 76.43,40.16 77.7,38.89 82.63,38.89 82.75,39.01 88.65,39.01 v89.2,38.86 | v107.7,41.07 106.89,41.88 U9.10
  Route2 0.127: v89.2,38.86 89.48,38.76 107.59,38.76 107.7,38.86 v107.7,41.07
ADDR1  (via drill 0.25)
  Top 0.127: U2.T15 68.98,29.74 69.37,30.14 v78.92,30.14 | v78.89,39.37 v90.12,39.37 | v106.43,39.5 106.43,45.29 106.32,45.39 106.32,45.84 U9.11
  Route2 0.127: v78.92,30.14 78.92,39.34 v78.89,39.37 | v90.12,39.37 106.3,39.37 v106.43,39.5
ADDR2  (via drill 0.25)
  Top 0.127: U2.R16 69.72,30.51 78.32,30.51 v78.44,30.63 | v78.21,39.45 78.21,39.57 78.51,39.88 89.71,39.88 v89.79,39.95 | v105.92,40.03 105.92,45.88 U9.12
  Route2 0.127: v78.44,30.63 78.44,38.91 v78.21,39.45 | v89.79,39.95 105.84,39.95 v105.92,40.03
ADDR3  (via drill 0.25)
  Top 0.127: U2.R15 68.93,30.55 69.32,30.94 77.85,30.94 v77.88,30.96 | v77.7,39.95 77.7,40.08 78,40.39 89.13,40.39 v89.23,40.49 | v105.38,40.61 U9.13
  Route2 0.127: v77.88,30.96 77.88,38.63 77.62,38.89 77.62,39.88 v77.7,39.95 | v89.23,40.49 105.26,40.49 v105.38,40.61
ADDR4  (via drill 0.25)
  Top 0.127: U2.P16 77.18,31.34 v77.34,31.5 | v77.22,40.72 77.37,40.87 88.62,40.87 v88.72,40.97 | v104.88,41.1 104.88,45.89 U9.14
  Route2 0.127: v77.34,31.5 77.34,38.61 77.14,38.81 77.14,40.64 v77.22,40.72 | v88.72,40.97 104.75,40.97 v104.88,41.1
ADDR5  (via drill 0.25)
  Top 0.127: U2.P15 69.32,31.74 76.43,31.74 76.53,31.83 v76.73,31.83 | v76.38,41.07 76.38,41.15 76.48,41.25 88.06,41.25 v88.29,41.48 | v104.42,41.66 104.42,45.88 U9.15
  Route2 0.127: v76.73,31.83 76.73,40.72 v76.38,41.07 | v88.29,41.48 104.24,41.48 v104.42,41.66
ADDR6  (via drill 0.25)
  Top 0.127: U9.50 81.13,37.53 v81.11,37.54 | v81.13,32.14 80.68,32.14 80.49,32.33 70.23,32.33 70.04,32.14 U2.N16
  Route2 0.127: v81.11,37.54 81.11,32.16 v81.13,32.14
ADDR7  (via drill 0.25)
  Top 0.127: U9.53 82.49,36.03 v82.49,36.02 | v82.4,32.96 69.73,32.96 U2.M16
  Route2 0.127: v82.49,36.02 82.5,36.02 82.5,33.02 82.44,32.96 v82.4,32.96
ADDR8  (via drill 0.25)
  Top 0.127: U9.54 81.78,35.53 v81.78,35.51 | v68.53,33.34 68.54,33.32 U2.M15
  Route2 0.127: v81.78,35.51 81.76,35.51 v81.74,33.48
  Route3 0.127: v81.74,33.48 81.74,33.08 81.61,32.89 68.9,32.89 v68.53,33.34
ADDR9  (via drill 0.25)
  Top 0.127: U9.55 v80.59,35.03 v80.58,35.03 | v80.54,33.52 80.24,33.73 79.3,34.34 70.38,34.34 69.76,33.72 69.75,33.72 U2.L16
  Route2 0.127: v80.58,35.03 80.58,33.76 v80.54,33.52
ADDR10  (via drill 0.25)
  Top 0.127: U9.56 83.85,34.53 v83.83,34.54 | v83.86,28.54 68.25,28.54 68.1,28.69 68.1,29.71 U2.T14
  Route2 0.127: v83.83,34.54 83.83,28.56 v83.86,28.54
ADDR11  (via drill 0.25)
  Top 0.127: U9.57 v84.51,34.03 v84.51,34.04 | v84.56,29.06 68.59,29.06 68.53,29.12 68.53,30.14 U2.R14
  Route2 0.127: v84.51,34.04 84.51,30.53 84.52,30.52 84.52,29.1 v84.56,29.06
ADDR12  (via drill 0.25)
  Top 0.127: 68.07,31.34 U2.P14 v68.52,30.95 | v71.2,27.99 71.07,28.07 v68.73,28.07 | v100.91,21.77 100.91,24.63 U9.87
  Route3 0.127: v71.2,27.99 71.2,26.31 73.86,23.65 83.31,23.65 84.33,22.63 93.83,22.63 94.59,21.87 100.81,21.87 v100.91,21.77 | v68.52,30.95 68.53,28.12 v68.73,28.07
ADDR13  (via drill 0.25)
  Top 0.127: U2.L14 68.13,33.75 v67.74,34.12 | v101.4,22.5 U9.88
  Route2 0.127: v67.74,34.12 67.74,34.19 67.97,34.42 72.59,34.42 72.64,34.37 72.64,28.75 v71.96,28.07
  Route3 0.127: v71.96,28.07 71.96,26.26 74.04,24.18 83.54,24.18 84.66,23.06 94.16,23.06 94.74,22.48 101.37,22.48 v101.4,22.5
ADDR14  (via drill 0.25)
  Top 0.127: U2.D14 68.1,39.34 v67.74,39.73
  Top 0.152: v101.9,23.75 101.9,24.64 U9.89
  Route2 0.127: v101.88,38.25 101.88,24.67
  Route2 0.152: 101.88,24.67 101.88,23.77 v101.9,23.75
  Route3 0.127: v67.74,39.73 68.53,40.54 73.25,40.54 73.79,40.01 75.41,40.01 75.84,40.44 76.4,40.44 77.14,39.7 77.14,39.67 77.93,38.89 85.39,38.89 85.6,39.09 88.47,39.09 88.75,39.37 89.41,39.37 89.87,38.91 101.47,38.91 v101.88,38.25
ADDR15  (via drill 0.25, 0.38)
  Top 0.127: U2.C14 68.15,40.14 68.53,40.54 74.52,40.54 v74.6,40.46
  Top 0.152: v102.39,25.86 U9.90
  Route2 0.127: v74.6,40.46 74.68,40.39 74.68,39.29 74.65,39.27 74.65,28.65 74.57,28.58 74.57,26.82 v74.55,26.8
  Route2 0.152: v102.41,28.37 102.41,25.88 v102.39,25.86
  Route3 0.127: v74.55,26.8 74.78,26.8 74.9,26.67 85.29,26.67 87.12,28.5 102.29,28.5 v102.41,28.37
AT_IRQ
  Top 0.127: 57.28,38.94 58.22,38.94 58.53,39.25 U2.D2
  Top 0.152: 35.66,44.81 36.32,45.77 46.99,45.77 50.34,42.42 54.64,42.42 55.52,41.53 55.52,39.27 55.85,38.94 57.28,38.94
  Top 0.203: 33.71,36.26 U1.40 33.68,40.64 35.66,42.62 35.66,44.81
AT_RESET_N  (via drill 0.25)
  Top 0.127: v60.35,28.3 60.35,28.45 59.72,29.08 59.72,30.15 U2.R3
  Top 0.203: U1.13 29.69,28.72 29.46,28.65 28.73,28.65 v28.37,28.58 | v27.25,18.44 27.08,18.26 27.08,16.41 27.28,16.21 60.2,16.21 v60.25,16.15
  Bottom 0.203: v27.25,18.44 27.84,19.02 27.84,23.8 28.73,24.69 28.73,27.58 28.37,27.94 v28.37,28.58 | v60.25,16.15 60.48,16.15 60.88,16.56 60.88,27.76 v60.35,28.3
ATRF_AVDD  (via drill 0.25, 0.6, 0.64)
  Top 0.203: C54.1 19.89,20 19.89,19.88
  Top 0.254: U3.1 22.06,21.78 22.33,21.51 22.33,20.17 22.02,19.86 21.34,19.86 U3.3
  Top 0.61: 19.89,19.88 U3.3 | v21.56,22.58 21.56,22.01 U3.1
  Top 0.813: v24.92,26.37 25.48,26.95 25.97,26.95 FB9.1 | C41.A 30.25,44.91 29.44,44.09 v29.44,43.64 | v29.44,43.64 v29.44,42.8 | v29.44,42.8 29.44,40.68 FB1.1 | v29.44,42.8 29.44,42.01 v29.41,41.99 | v29.44,43.64 29.44,43.91 29.44,43.92 29.44,44.04 | v53.31,48.82 54.34,48.82 FB13.2
  Route2 0.813: 33.73,49.81 52.1,49.81 v53.31,48.82 | 33.73,49.81 33.68,49.86 | 33.73,49.81 31.5,49.81 30.58,48.9 30.58,45.24 29.44,44.09 v29.41,41.99 27.36,41.99 25.27,40.16 v22.1,40.16 | v20.65,24.56 21.62,23.57 | 21.62,23.57 24,23.57 24.89,24.28 24.89,25.45 v24.92,26.37 | 21.62,23.57 21.62,22.63 v21.56,22.58
  Bottom 0.813: v22.1,40.16 20.55,40.16 20.47,40.08 19.38,39.01 19.33,31.04 19.71,29.57 19.71,26.72 19.76,25.7 v20.65,24.56
ATRF_CS
  Top 0.127: 57.35,39.74 58.19,39.74 58.53,40.09 U2.C2
  Top 0.152: 34.54,46 35.13,46.69 47.42,46.69 50.93,43.18 54.84,43.18 56.29,41.73 56.29,39.93 56.46,39.75 57.35,39.74
  Top 0.203: U1.42 32.69,36.58 32.82,36.7 32.82,41.1 34.54,42.82 34.54,46
ATRF_DVDD  (via drill 0.25, 0.64)
  Top 0.406: FB11.2 v42.42,29.16 | v38.91,31.12 39.32,31.52 C44.A | v38.94,30.45 39.4,30.91 40.03,30.91 | v38.94,32.79 39.07,32.66 40.06,32.66 | v54.53,34.42 54.34,34.43 FB5.2 | 54.33,24.89 v54.31,24.89 53.81,24.88 FB8.2 | v54.32,20.29 54.01,20.28 FB7.2 | v54.53,29.54 53.86,29.53 FB6.2 | v54.61,39.14 v54.6,39.15 FB4.2
  Top 0.61: FB2.2 40.91,19.61 v41.76,19.61 | FB10.2 v35.48,40.82
  Top 0.813: FB12.2 54.34,46.58 v53.42,46.58 | v54.33,45.47 54.33,46.61
  Route2 0.406: v54.31,24.89 51,24.89 | 50.9,29.46 50.98,29.46 51,29.49 51,29.46 54.41,29.46 54.51,29.57 v54.53,29.54 | v54.53,34.42 54.33,34.21 51.1,34.21 | v54.32,20.29 54.29,20.32 51.1,20.32 | v54.61,39.14 54.56,39.09 51.08,39.09
  Route2 0.813: v53.42,46.58 53.54,46.51 53.54,44.73 | v54.33,45.47 54.33,44.75
  pour Route2 (isolate 0.254, no thermals): 54.79,45.06 46.94,45.06 46,46 41.07,46 37.26,42.19 33.4,42.19 32.49,41.27 32.49,36.37 33.05,35.81 35.18,35.81 35.59,35.41 35.59,30.66 34.87,29.95 33.15,29.95 32.99,29.59 32.99,26.95 33.17,26.64 35.74,26.59 36.4,25.88 36.42,23.34 37.34,22.48 37.41,19.58 38.43,18.31 51.51,18.39 51.51,19.89 51.13,20.93 51.16,41 54.79,44.32
ATRF_MISO
  Top 0.152: 33.5,46.96 33.96,47.47 47.85,47.47 51.26,44.07 55.42,44.07 57.02,42.47 57.02,41.02 57.12,40.92 57.71,40.92 U2.B1
  Top 0.203: U1.44 31.7,36.75 31.98,37.08 31.98,41.48 33.5,42.95 33.5,46.96
ATRF_MOSI
  Top 0.152: 34.04,46.53 34.57,47.07 47.65,47.07 51.1,43.61 55.12,43.61 56.64,42.09 56.64,40.39 56.9,40.13 U2.C1
  Top 0.203: U1.43 32.18,36.58 32.41,36.86 32.41,41.33 34.04,42.9 34.04,46.53
ATRF_SCLK
  Top 0.152: 35.05,45.44 35.69,46.25 47.04,46.25 50.5,42.8 54.76,42.8 55.85,41.71 55.85,39.52 56.04,39.34 U2.D1
  Top 0.203: U1.41 33.2,40.84 35.05,42.7 35.05,45.44
AUDIO_LEFT
  Top 0.406: R38.1 150.35,12.9 C79.1 | 151.87,11.46 153.13,12.72 J2.R
  Top 0.813: C79.1 152.01,12.94 152.04,12.98 153.77,12.98 J2.R
  pour Top (no thermals): 151.69,14.96 156.16,14.96 156.44,14.68 156.44,11.15 156.03,10.74 151.79,10.74 151.28,11.25 151.28,14.53
AUDIO_RIGHT
  Top 0.406: R37.1 156.96,5.16 C78.1
  Top 0.813: C78.1 J2.L
  pour Top (no thermals): 159.18,7.52 163.65,7.52 163.93,7.24 163.93,3.71 163.53,3.3 159.28,3.3 158.78,3.81 158.78,7.09
B1  (via drill 0.25)
  Top 0.152: U2.A5 60.93,42.67 61.57,43.31 61.57,46.33 v61.44,46.43 | SW1.1 61.8,69.77 61.49,69.47 v61.49,61.8
  Top 0.254: SW1.1 62.84,71.48 62.81,71.45 R15.2
  Top 1.27: SW1.1 SW1.2
  Route2 0.152: v61.49,61.8 61.52,61.77 61.11,61.37 61.11,46.76 v61.44,46.43
B2  (via drill 0.25)
  Top 0.152: U2.A6 61.95,41.96 v61.95,47.19 | SW2.1 62.38,55.83 61.99,55.44 61.95,55.4 61.82,55.27 v61.82,54.94
  Top 0.254: SW2.2 67.34,55.84 R17.2
  Top 1.27: SW2.1 SW2.2
  Route2 0.152: v61.95,47.19 61.95,54.81 v61.82,54.94
B3  (via drill 0.25)
  Top 0.152: U2.A7 62.51,41.76 v62.51,51.36 | v60.86,62.61 60.78,62.69
  Top 0.254: R18.2 59.91,64.13 SW3.2
  Top 0.406: 60.78,62.69 SW3.2
  Top 1.27: SW3.1 SW3.2
  Route2 0.152: v62.51,51.36 62.48,51.38 62.48,62.36 62.23,62.61 v60.86,62.61
B4  (via drill 0.25)
  Top 0.152: U2.B5 v61.32,41.32 v61.32,41.33 | v62.97,45.62 63.2,45.85 v63.2,49.94 | v69.16,62.76 69.24,62.69
  Top 0.254: SW4.2 74.65,62.7 R19.2
  Top 0.406: 69.24,62.69 SW4.1
  Top 1.27: SW4.1 SW4.2
  Route2 0.152: v61.32,41.33 61.59,41.61 61.59,45.36 61.85,45.62 v62.97,45.62 | v63.2,49.94 63.42,50.17 63.42,62.33 63.86,62.76 v69.16,62.76
B5  (via drill 0.25)
  Top 0.152: U2.B6 62.12,41.33 v62.13,41.34 | v63.17,44.5 64.06,45.69 v64.06,50.37 | v77.9,59.28 77.93,59.31
  Top 0.254: R21.2 84.62,59.31 SW5.2
  Top 0.406: 77.93,59.31 SW5.1
  Top 1.27: SW5.1 SW5.2
  Route2 0.152: v62.13,41.34 62.51,41.73 62.51,43.74 v63.17,44.5 | v64.06,50.37 64.24,50.55 64.24,58.55 65.23,59.54 69.42,59.54 69.8,59.92 77.5,59.92 77.9,59.51 v77.9,59.28
B6  (via drill 0.25)
  Top 0.152: U2.B7 v62.92,41.33 | v62.92,41.33 | 77.72,51.31 v77.7,51.28 77.46,51.04 | v63.27,42.95 64.44,45.44 64.44,49.45 64.95,49.96 v67.46,49.96 | 77.42,51 77.46,51.04 | v70.79,49.96 70.82,49.99 77.01,49.99 77.46,50.43 77.46,51.04
  Top 0.254: R20.2 84.69,51.31 SW6.2
  Top 0.406: 77.72,51.31 SW6.1
  Top 1.27: SW6.1 SW6.2
  Route2 0.152: v62.92,41.33 62.92,42.52 v63.27,42.95
  Bottom 0.152: v67.46,49.96 v70.79,49.96
CBSEL  (via drill 0.25)
  Top 0.127: U2.P13 67.73,30.92 67.73,28.4 67.74,28.19 v67.84,28.09 | v102.87,21.08 102.89,21.1 U9.91
  Route3 0.127: v67.84,28.09 68.76,27.08 68.76,25.68 72.8,21.64 82.22,21.64 83.31,20.55 92.35,20.55 93.22,20.09 96.44,20.09 97.38,20.68 102.72,20.68 102.87,20.83 v102.87,21.08
CDONE  (via drill 0.25)
  Top 0.127: U2.M10 64.92,32.94 v64.53,32.54 | v92.43,18.54 103.02,18.54 v103.07,18.49 | v103.38,22.73 103.38,23.22 103.33,23.29 103.33,23.98 103.4,24.13 U9.92
  Route2 0.127: v64.53,32.54 64.47,32.49 64.47,31.19 64.85,30.81 64.85,29.18 65.68,28.35 65.68,27.53 66.75,26.47 69.29,26.47 70.43,25.32 74.88,25.32 75.87,24.33 83.21,24.33 84.45,23.09 91.9,23.09 92.2,22.78 92.2,18.77 v92.43,18.54 | v103.07,18.49 103.07,19.99 103.43,20.35 103.43,22.68 v103.38,22.73
CRESET_B  (via drill 0.25)
  Top 0.127: U2.N11 v65.33,32.54 | v65.33,32.54 | v93.27,19.18 103.68,19.18 v103.89,18.97 | v103.89,23.57 U9.93
  Route2 0.127: v65.33,32.54 64.95,32.16 64.95,31.55 65.25,31.24 65.25,29.39 66.04,28.6 66.04,27.81 67.01,26.85 69.7,26.85 70.71,25.83 75.18,25.83 75.92,25.1 83.29,25.1 84.73,23.65 92.56,23.65 92.99,23.22 92.99,19.46 v93.27,19.18 | v103.89,18.97 v103.89,23.57
DATA0  (via drill 0.25)
  Top 0.127: U2.D16 69.73,39.35 70.13,39.75 74.07,39.75 74.22,39.6 76.1,39.6 v76.23,39.73 | v99.9,26.21 99.9,24.67 U9.85
  Route2 0.127: v76.23,39.73 76.23,26.26 v76.28,26.14
  Route3 0.127: v76.28,26.14 76.43,26.11 90.68,26.11 90.86,25.93 91.47,25.93 91.64,26.11 98.48,26.11 98.63,26.26 99.82,26.26 v99.9,26.21
DATA1  (via drill 0.25)
  Top 0.127: U2.D15 68.94,39.34 69.34,38.94 70.15,38.94 70.48,39.27 74.07,39.27 v74.19,39.14 | v100.48,25.81 100.48,25.7 100.41,25.63 100.41,24.67 U9.86
  Route2 0.127: v74.19,39.14 74.19,27.38 v73.76,26.95
  Route3 0.127: v73.76,26.95 73.76,26.54 74.6,25.55 86.99,25.55 87.66,25.04 99.72,25.04 v100.48,25.81
DATA2  (via drill 0.25)
  Top 0.127: U2.B16 75.03,40.94 v75.08,40.89 | v110.08,28.83 110.19,28.78 111.58,28.78 112.62,29.03 U9.114
  Route2 0.127: v75.08,40.89 75.11,40.92 v75.11,27.74
  Route3 0.127: v75.11,27.74 75.82,27.03 85.06,27.03 86.92,28.88 109.93,28.88 v110.08,28.83
DATA3  (via drill 0.25)
  Top 0.127: U2.B15 69.34,41.34 75.62,41.34 v75.72,41.28 | v110.85,29.29 111.09,29.53 U9.115
  Route2 0.127: v75.72,41.28 75.69,41.25 v75.69,28.09
  Route3 0.127: v75.69,28.09 76.4,27.38 84.81,27.38 86.72,29.29 v110.85,29.29
DATA4  (via drill 0.25)
  Top 0.127: U2.A16 v83.18,41.74 | U9.58 83.18,33.53 v83.18,33.54
  Route2 0.127: v83.18,41.74 v83.2,41.74 v83.18,33.54
DATA5  (via drill 0.25)
  Top 0.127: U9.59 85.19,33.03 v85.13,32.97 | v85.18,42.47 69.11,42.47 68.92,42.28 U2.A15
  Route2 0.127: v85.13,32.97 85.13,42.42 v85.18,42.47
DATA6  (via drill 0.25)
  Top 0.127: U9.60 85.79,32.53 v85.76,32.5 | v85.78,38.52 69.75,38.52 U2.E16
  Route2 0.127: v85.76,32.5 85.76,38.51 v85.78,38.52
DATA7  (via drill 0.25)
  Top 0.127: U9.63 86.43,31.03 v86.41,31.01 | v86.41,38.02 70.26,38.02 70.15,38.14 69.37,38.14 U2.F15
  Route2 0.127: v86.41,31.01 v86.41,38.02
DATA8  (via drill 0.25)
  Top 0.127: U9.64 v87.12,30.53 | v87.07,37.08 80.62,37.08 80.04,37.72 69.75,37.72 U2.F16
  Route2 0.127: v87.12,30.53 87.12,37.08 v87.07,37.08
DATA9  (via drill 0.25)
  Top 0.127: U9.65 87.77,30.03 v87.76,30.05 | v87.78,36.53 83.34,36.53 83.13,36.68 80.37,36.68 79.73,37.34 69.3,37.34 U2.G15
  Route2 0.127: v87.76,30.05 87.76,36.45 v87.78,36.53
DATA10  (via drill 0.25)
  Top 0.127: U9.66 80,29.53 v79.98,29.51 | v79.98,36.37 79.98,36.4 79.45,36.93 U2.G16
  Route2 0.127: v79.98,29.51 v79.98,36.37
DATA11  (via drill 0.25)
  Top 0.127: U9.67 85.34,29.03 84.25,27.94 79.48,27.94 v79.45,27.91 | v79.45,35.74 69.3,35.74 U2.J15
  Route2 0.127: v79.45,27.91 v79.45,35.74
DATA12  (via drill 0.25)
  Top 0.127: U2.J16 78.96,35.34 79.73,34.57 82.37,34.57 82.65,34.29 82.65,33.4 83.01,33.05 v83.06,32.79 | v93.17,31.39 93.17,28.68 93.01,28.52 U9.68
  Route3 0.127: v83.06,32.79 83.08,32.51 83.54,31.98 90.91,31.98 90.96,32.03 91.57,32.03 91.62,31.98 92.58,31.98 v93.17,31.39
DATA13  (via drill 0.25)
  Top 0.127: U2.K15 v69.32,34.93 | v69.32,34.93 | v95.88,21.23 95.88,24.59 U9.77
  Route2 0.127: v72.06,33.53 72.06,33.5 72.09,29.03 71.65,28.6 70.64,28.6 70.56,28.52 v70.56,27.41
  Route3 0.127: v70.56,27.41 70.56,26.24 73.69,23.11 83.03,23.11 84.2,22.07 93.47,22.07 94.51,21.49 95.28,21.23 v95.88,21.23
  Bottom 0.127: v69.32,34.93 69.75,35.38 71.86,35.38 72.11,35.13 v72.06,33.53
DATA14  (via drill 0.25)
  Top 0.127: U2.K16 69.73,34.55 70.1,34.93 73.1,34.93 v73.15,34.87 | v96.42,23.22 96.42,24.63 U9.78
  Route2 0.127: v73.15,34.87 73.15,28.42 v72.75,28.02
  Route3 0.127: v72.75,28.02 72.75,27.94 72.52,27.71 72.52,26.37 74.22,24.66 83.92,24.66 84.96,23.62 94.36,23.62 94.89,23.09 96.29,23.09 v96.42,23.22
DATA15  (via drill 0.25)
  Top 0.127: v85.19,30.05 85.17,30.07 79.71,30.07 79.2,29.57 70.13,29.57 69.98,29.59 69.88,29.69 U2.T16 | v96.9,23.75 96.9,24.65 U9.79
  Route2 0.127: v85.19,30.05 85.19,25.27 v85.45,25.02
  Route3 0.127: v85.45,25.02 87.05,25.02 87.48,24.59 96.8,24.59 96.9,24.49 v96.9,23.75
DISP_BL_EN  (via drill 0.25)
  Top 0.152: v66.12,40.55 U2.B11 | v45.14,66.7 46.1,67.67 52.15,67.67 53.75,66.07 53.75,61.06 53.85,60.96 68.83,60.96 69.06,60.73 v69.06,58.52 | v65.74,43.31 65.74,44.88 66.57,45.72 67.79,45.72 68.94,46.86 68.94,46.89 69.24,47.19 v69.24,47.57
  Route2 0.152: v65.74,43.31 65.68,43.13 65.68,40.97 66.04,40.61 v66.12,40.55 | v69.06,58.52 69.24,58.34 v69.24,47.57
  Bottom 0.152: Q16.1 45.14,65.59 v45.14,66.7
DISP_CSB  (via drill 0.25)
  Top 0.152: U10.3 24.74,54.31 24.74,57.86 25.58,58.7 52.48,58.7 53.06,58.12 53.06,54.61 53.8,53.87 68.73,53.87 69.21,53.39 69.21,49.4 67.08,47.27 v66.73,47.27 | U2.B9 v64.52,40.55
  Bottom 0.152: v66.73,47.27 66.65,47.35 65.46,47.35 64.49,46.38 64.49,40.65 arc28 v64.52,40.55
DISP_RS  (via drill 0.25)
  Top 0.152: U10.2 23.19,57.73 24.84,59.39 52.73,59.39 53.72,58.39 53.72,54.97 54.38,54.31 69.65,54.31 69.88,54.08 69.88,49.2 v67.34,46.66 | U2.B10 65.35,40.51 v65.33,40.54
  Bottom 0.152: v65.33,40.54 64.87,41 64.87,46.05 65.48,46.66 v67.34,46.66
DISP_RST  (via drill 0.25)
  Top 0.152: U2.A9 64.24,41.85 64.24,43.08 64.85,45.24 64.85,48.69 65.25,49.1 v66.42,49.1 | v60.4,60.27 66.01,60.27 66.14,60.15 v66.14,58.72
  Route2 0.152: U10.1 21.7,59.42 22.43,60.15 60.27,60.15 v60.4,60.27 | v66.14,58.72 66.14,49.17 66.17,49.15 66.37,49.15 v66.42,49.1
DISP_SCL  (via drill 0.25)
  Top 0.152: U10.4 26.26,54.34 26.26,57.89 26.59,58.22 51.99,58.22 52.4,57.81 52.4,54.25 53.26,53.39 68.22,53.39 68.61,53.01 68.61,49.76 v66.9,48.06 | U2.B8 v63.73,40.54
  Bottom 0.152: v63.73,40.54 64.06,40.87 64.06,46.71 65.4,48.06 v66.9,48.06
DISP_SI  (via drill 0.25)
  Top 0.152: U2.A10 64.92,41.74 64.92,43.54
  Top 0.203: v58.27,57.66 v65.48,57.66 | v65.4,45.69 65.3,45.59 65.3,43.92 64.92,43.54
  Route2 0.203: U10.5 27.7,57.54 28.32,58.17 57.76,58.17 v58.27,57.66 | v65.48,57.66 65.48,45.77 v65.4,45.69
ETH_RMII_REF_CLK
  Top 0.254: U18.14 104.89,56.77 R76.2 | U9.35 94.39,46.88 94.39,46.89 94.39,46.91 93.9,47.19 92.81,47.19 92.63,47.37 92.63,50.09 arc-90 92.86,50.31 93.99,50.31 arc90 94.22,50.53 94.22,50.57 arc90 93.99,50.8 92.86,50.8 arc-90 92.63,51.02 92.63,51.06 arc-90 92.86,51.28 93.99,51.28 arc90 94.22,51.51 94.22,51.55 arc90 93.99,51.77 92.86,51.77 arc-90 92.63,51.99 92.63,52.65 92.96,53.11 100.53,53.11 103.94,56.52 104.64,56.52 R76.2 | 104.65,56.57 104.69,56.57 R76.2
ETH_RX+  (via drill 0.25)
  Top 0.152: 136.27,65.51 136.37,65.41 | 136.37,64.34 136.48,64.24
  Top 0.203: U18.23 110.82,62.22 R23.2 111.81,63.17 112.6,63.96 131.27,63.96 132.82,65.51 136.27,65.51 | 136.37,65.41 136.37,64.34
  Top 0.254: v137.64,64.26 136.48,64.24 Z2.3
  Route2 0.254: J1.4 142.98,61.37 v137.64,64.26
ETH_RX-  (via drill 0.25)
  Top 0.152: R4.2 111.94,61.6
  Top 0.203: U18.22 111.68,61.72 | 111.94,61.6 112.7,62.36 132.11,62.36 132.92,63.17 135.51,63.17 Z2.2
  Top 0.254: 111.68,61.72 R4.2 | Z2.2 v137.39,61.98
  Route2 0.203: 150.11,58.85 J1.6
  Route2 0.254: 150.11,58.85 144.86,58.85 v137.39,61.98
ETH_TX+
  Top 0.152: R1.2 111.9,59.96 | 136.14,59.31 Z1.3
  Top 0.203: U18.21 110.36,61.22 111.56,60.02 | 111.9,59.96 112.65,59.21 132.33,59.21 133.4,60.27 136.02,60.27 136.14,60.15 136.14,59.31
  Top 0.254: 111.56,60.02 111.88,60.02 R1.2 | Z1.3 145.52,62.84 J1.1
ETH_TX-
  Top 0.152: R3.2 111.93,57.92 | 136.25,57.25 136.25,56.97 Z1.2
  Top 0.203: U18.20 109.6,60.72 R3.2 | 111.93,57.92 112.8,57.05 130.73,57.05 131.75,58.06 135.43,58.06 136.25,57.25
  Top 0.254: Z1.2 137.29,56.95 139.4,59.06 J1.3
FGPA_RX900
  Top 0.127: R8.1 56.38,28.96 arc90 56.44,29.17 56.13,29.71 arc-90 56.19,29.93 56.19,29.93 arc-90 56.41,29.87 56.72,29.34 arc90 56.93,29.28 56.94,29.28 arc90 56.99,29.5 56.69,30.03 arc-90 56.74,30.25 56.75,30.25 arc-90 56.96,30.19 57.27,29.66 arc90 57.49,29.6 U2.T1
FPGA_CFG_CS
  Top 0.127: U2.R12 66.13,30.13 66.13,29.34 66.24,29.21 66.45,29.01 66.45,28.3 67.54,27.2 69.27,27.2 69.49,26.97 69.49,26.49 70.21,25.63 83.97,25.63 85.65,24.1 85.67,24.1 89.33,20.45 105.84,20.45 105.89,20.5 U9.97
FPGA_RX24
  Top 0.127: 57.72,37.74 57.4,37.74 arc90 57.25,37.59 57.25,36.9 arc-90 57.09,36.74 57.06,36.74 arc-90 56.9,36.9 56.9,37.59 arc90 56.74,37.74 56.71,37.74 arc90 56.55,37.59 56.55,36.9 arc-90 56.4,36.74 56.37,36.74 arc-90 56.21,36.9 56.21,37.59 arc90 56.05,37.74 55.21,37.74 R16.2
  Top 0.152: 57.72,37.74 U2.F1
FPGA_RXCLK
  Top 0.127: R29.2 56.18,32.97 56.39,33.17 56.39,34.7 56.62,34.94 58.92,34.94 U2.J3
FPGA_TX_24_900  (via drill 0.25)
  Top 0.127: U2.T2 58.52,28.6 v58.04,28.12 | v55.91,23.47 55.6,23.5 R13.1
  Route2 0.127: v58.04,28.12 58.01,28.09 58.01,27.5 arc-90 57.85,27.34 arc90 57.7,27.18 57.7,27.13 arc90 57.85,26.97 58.17,26.97 arc-90 58.33,26.82 58.33,26.77 arc-90 58.17,26.61 57.85,26.61 arc90 57.7,26.45 57.7,26.4 arc90 57.85,26.24 58.17,26.24 arc-90 58.33,26.08 58.33,26.03 arc-90 58.17,25.87 57.85,25.87 arc90 57.7,25.71 57.7,25.66 arc90 57.85,25.5 58.17,25.5 arc-90 58.33,25.35 58.33,25.3 arc-90 58.17,25.14 57.85,25.14 arc90 57.7,24.98 57.7,24.93 arc90 57.85,24.77 58.17,24.77 arc-90 58.33,24.61 58.33,24.56 arc-90 58.17,24.4 57.85,24.4 arc90 57.7,24.24 57.7,24.19 arc90 57.85,24.03 arc-90 58.01,23.88 57.61,23.47 57.24,23.47 arc90 57.08,23.31 57.08,22.91 arc-90 56.92,22.75 56.65,22.75 arc-90 56.5,22.91 56.5,23.31 arc90 56.34,23.47 v55.91,23.47
FPGA_TXCLK  (via drill 0.25)
  Top 0.127: U2.T3 v59.33,28.24 | v56.01,18.9 55.96,18.85 R14.1
  Route2 0.127: v59.33,28.24 59.31,28.22 59.31,19.2 59,18.9 v56.01,18.9
FPGA_VCC_1V2  (via drill 0.25)
  Top 0.127: v58.14,34.13 v58.14,34.14 | U2.K6 | 61.73,37.71 U2.F6 | 64.92,37.74 U2.F10 | 64.9,34.54 U2.K10